# EAGLE design cfc-sensor-card (EAGLE 9.5.1)

## Sheet 1 of 4: Connectors
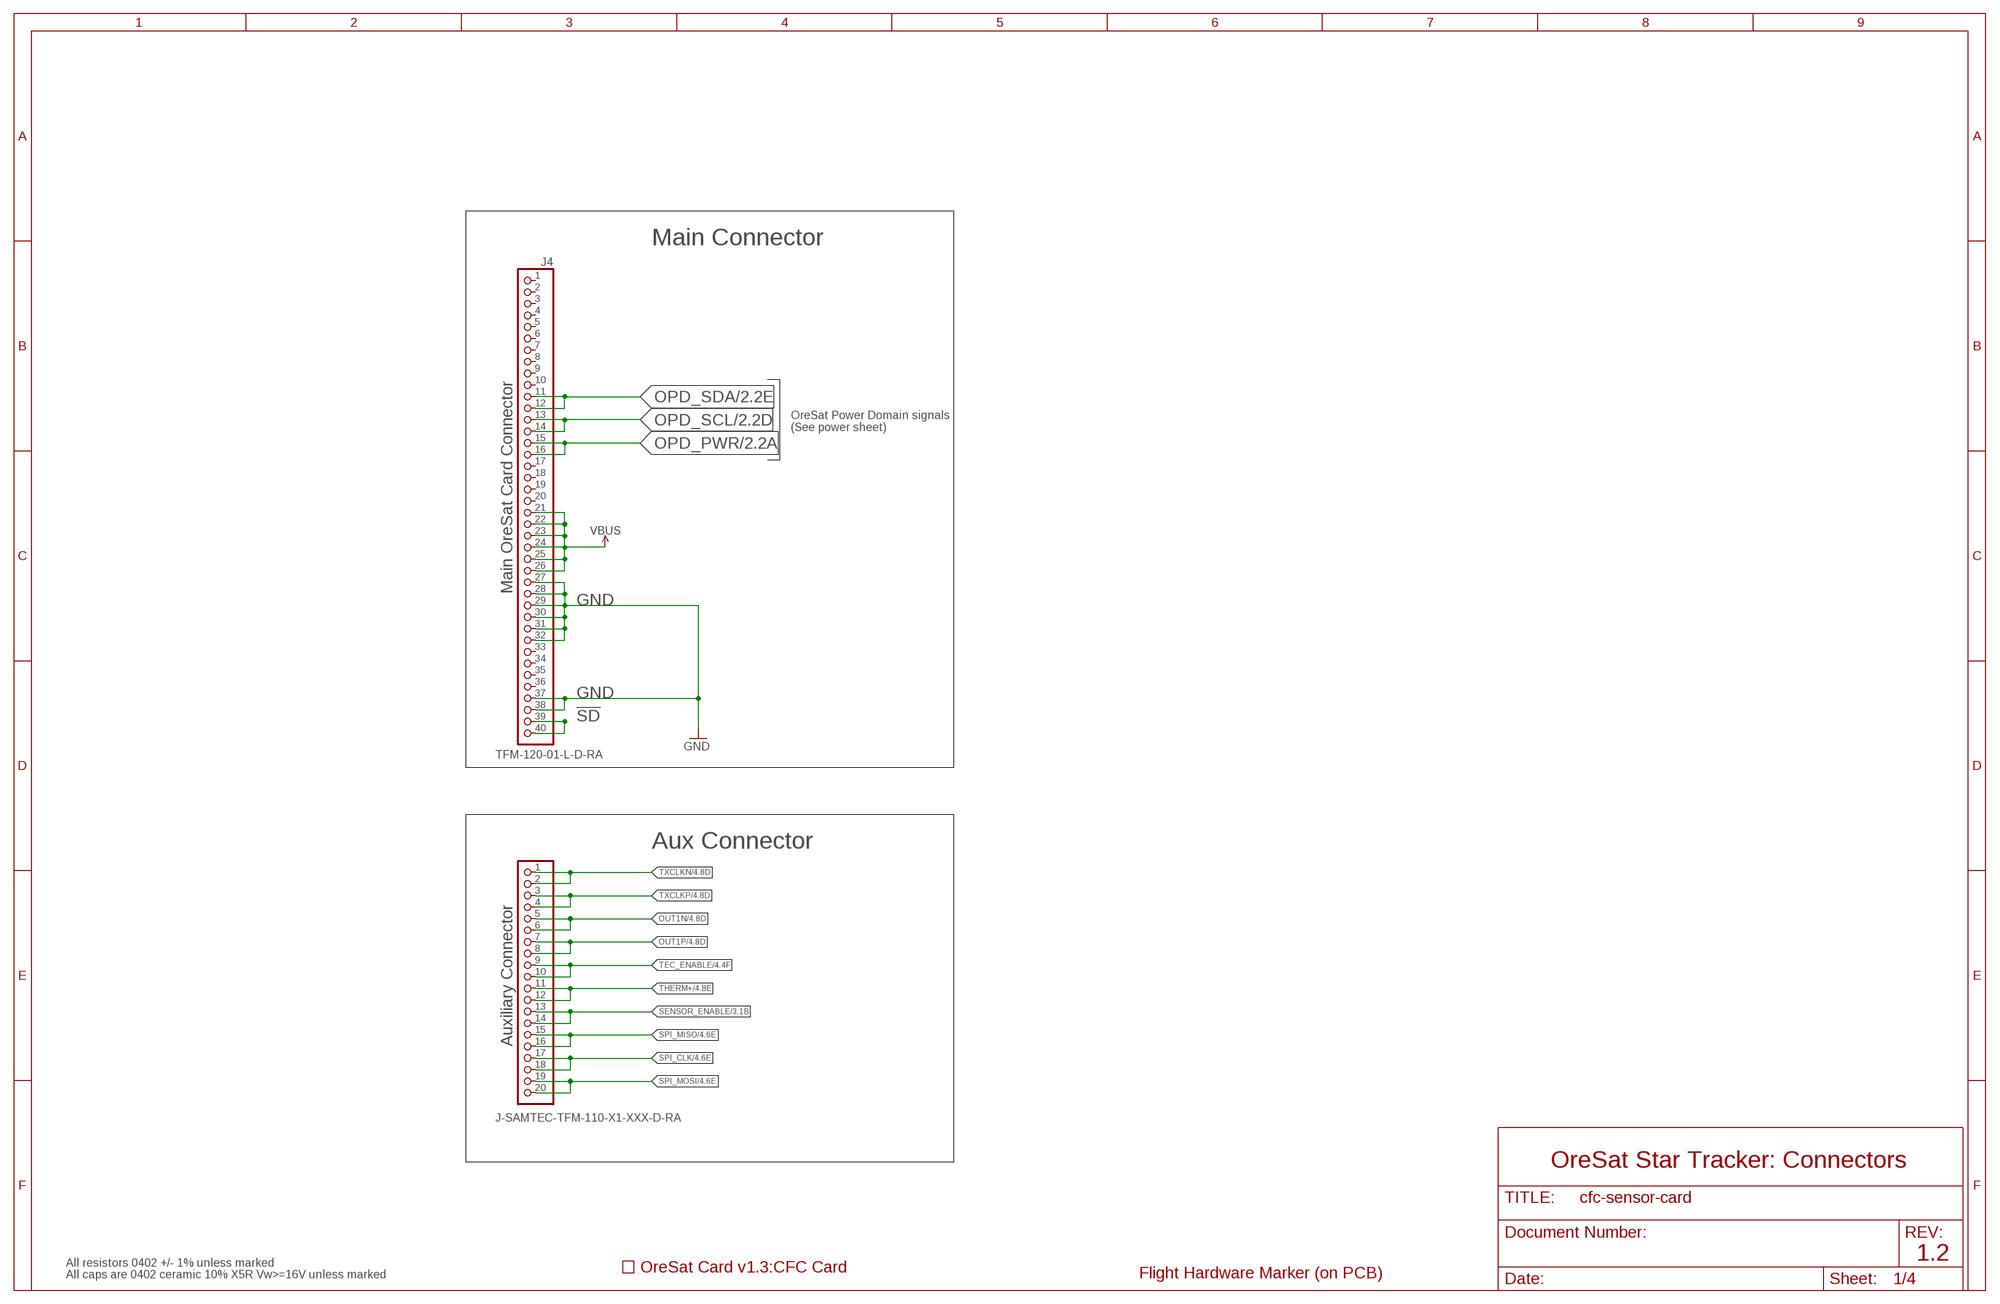
[diagram p0: schematic, sheet 1]

### Parts
J2  J-SAMTEC-TFM-110-X1-XXX-D-RA  [J-SAMTEC-TFM-110-X1-XXX-D-RA]
J4  TFM-120-01-L-D-RA  J-SAMTEC-TFM-120-X1-XXX-D-RA  [J-SAMTEC-TFM-120-X1-XXX-D-RA]
PCB1  ORESAT-CARD-V1.3-CFC  [ORESAT-CARD-V1.3-CFC]
U$1  FLIGHMARKERNEW  [FLIGHTMARKER_NEW_BOARDS]

### Nets
!SD: J4.39 J4.40
GND: J4.27 J4.28 J4.29 J4.30 J4.31 J4.32 J4.37 J4.38 ; also sheet 2,3,4
OPD_PWR: J4.15 J4.16 ; also sheet 2
OPD_SCL: J4.13 J4.14 ; also sheet 2
OPD_SDA: J4.11 J4.12 ; also sheet 2
OUT1N [diff pair]: J2.5 J2.6 ; also sheet 4
OUT1P [diff pair]: J2.7 J2.8 ; also sheet 4
SENSOR_ENABLE: J2.13 J2.14 ; also sheet 3
SPI_CLK: J2.17 J2.18 ; also sheet 4
SPI_MISO: J2.15 J2.16 ; also sheet 4
SPI_MOSI: J2.19 J2.20 ; also sheet 4
TEC_ENABLE: J2.9 J2.10 ; also sheet 4
THERM+: J2.11 J2.12 ; also sheet 4
TXCLKN [diff pair]: J2.1 J2.2 ; also sheet 4
TXCLKP [diff pair]: J2.3 J2.4 ; also sheet 4
VBUS: J4.21 J4.22 J4.23 J4.24 J4.25 J4.26 ; also sheet 2
Unconnected: J4.1 J4.2 J4.3 J4.4 J4.5 J4.6 J4.7 J4.8 J4.9 J4.10 J4.17 J4.18 J4.19 J4.20 J4.33 J4.34 J4.35 J4.36

### Notes on the sheet
- Main Connector
- OreSat Power Domain signals
  (See power sheet)
- Main OreSat Card Connector
- Aux Connector
- Auxiliary Connector
- OreSat Star Tracker: Connectors
- 1.2
- All resistors 0402 +/- 1% unless marked
- All caps are 0402 ceramic 10% X5R Vw>=16V unless marked

## Sheet 2 of 4: OPD
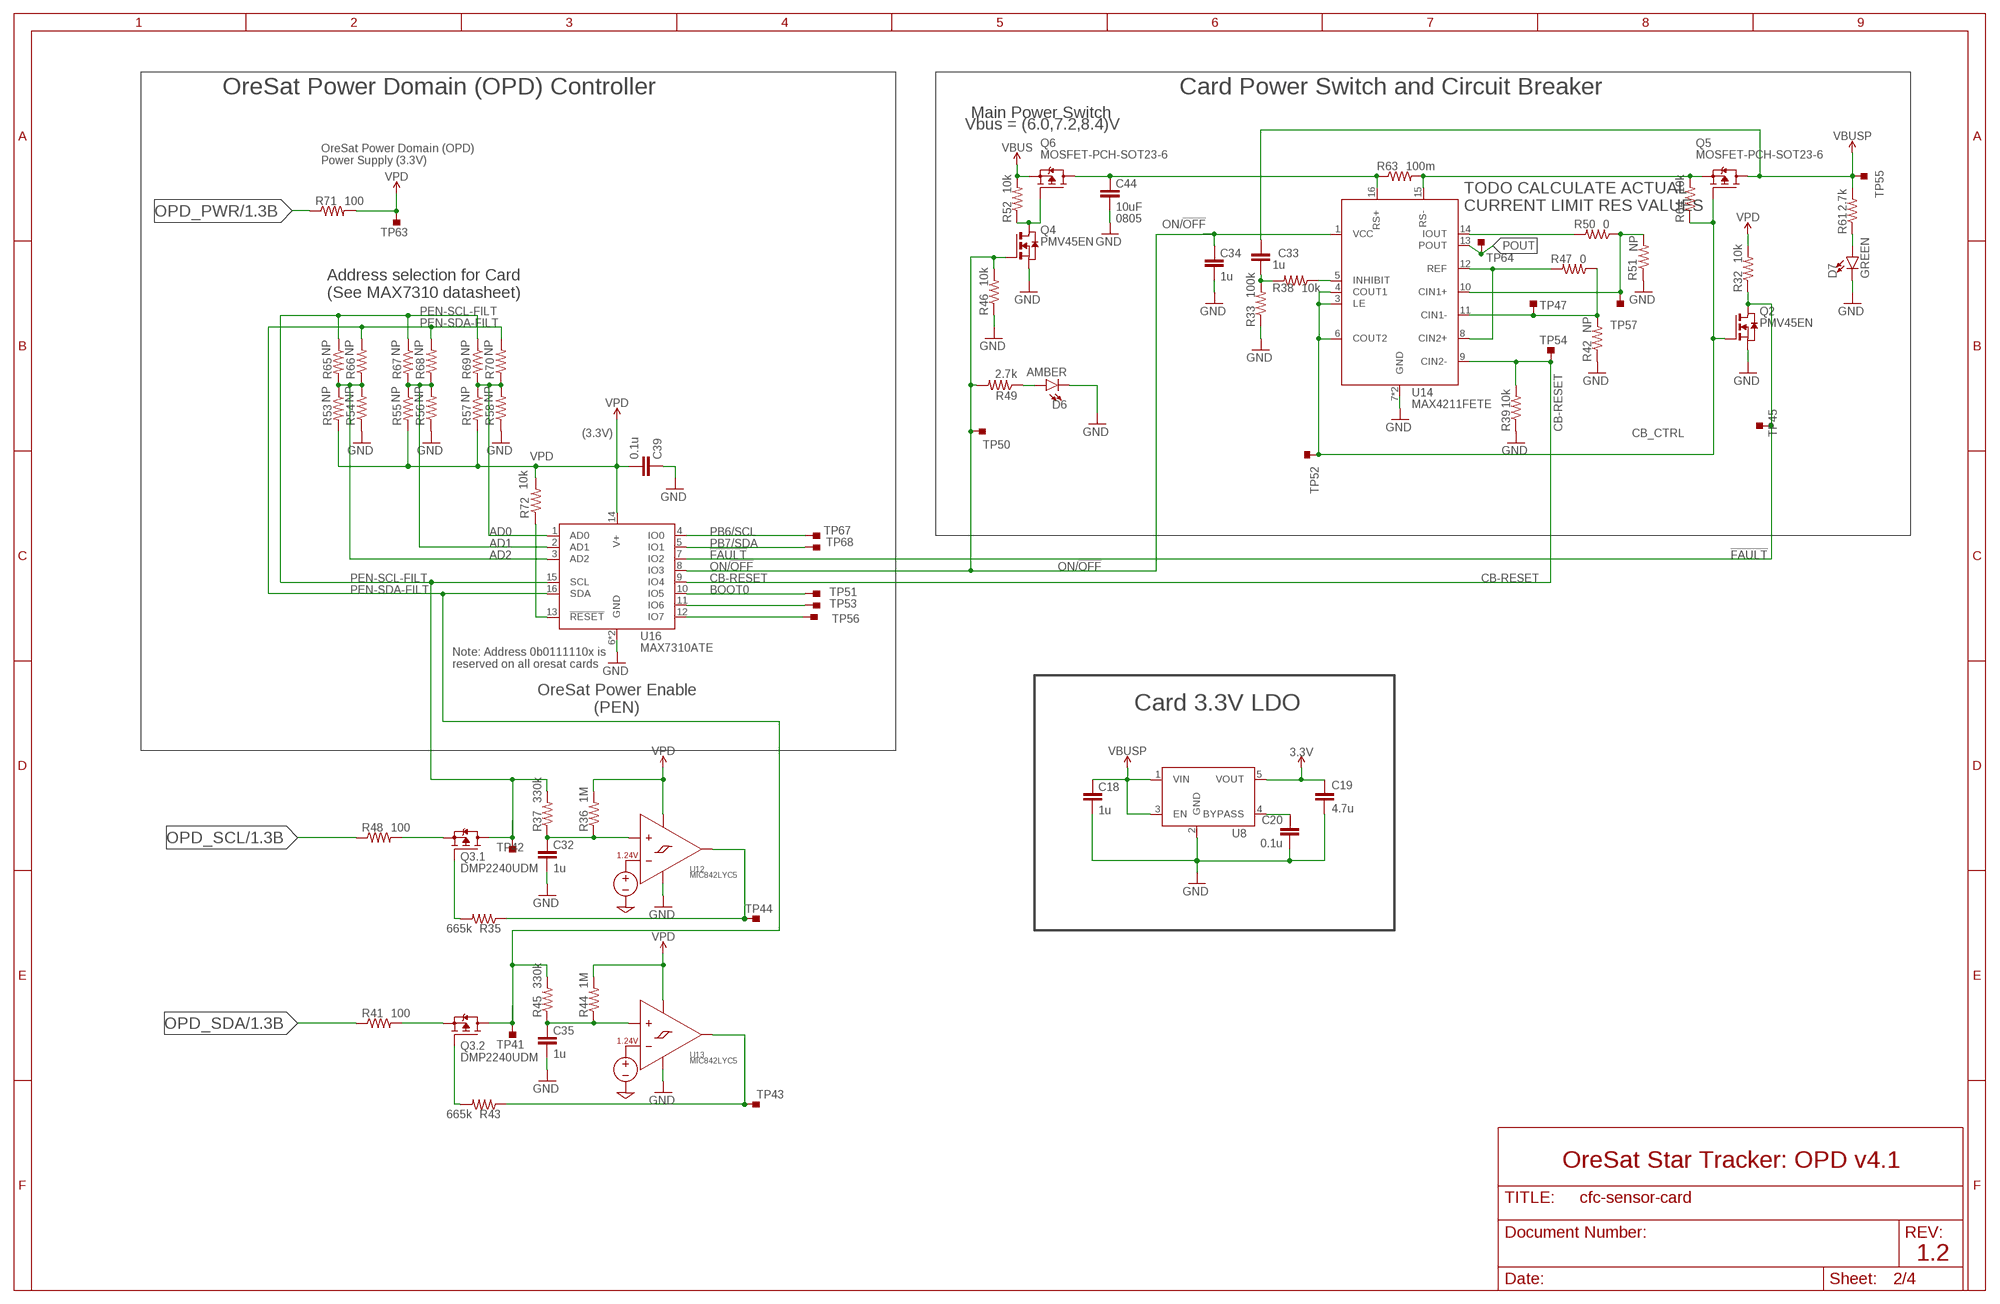
[diagram p1: schematic, sheet 2]

### Parts
C18  1u  C-EU0603-B  [.0603-B]
C19  4.7u  C-EU0603-B  [.0603-B]
C20  0.1u  C-EU0603-B  [.0603-B]
C32  1u  C-EU0603-B  [.0603-B]
C33  1u  C-EU0603-B  [.0603-B]
C34  1u  C-EU0603-B  [.0603-B]
C35  1u  C-EU0603-B  [.0603-B]
C39  0.1u  C-EU0603-B  [.0603-B]
C44  10uF  C-EU0603-B  [.0603-B]
D6  AMBER  LED-GREEN0603  [LED-0603]
D7  GREEN  LED-GREEN0603  [LED-0603]
Q2  PMV45EN  [SOT23]
Q3  DMP2240UDM  MOSFET-PCH-SOT23-6  [SOT23-6]
Q4  PMV45EN  [SOT23]
Q5  MOSFET-PCH-SOT23-6  [SOT23-6]
Q6  MOSFET-PCH-SOT23-6  [SOT23-6]
R32  10k  R-US_0603-B  [.0603-B]
R33  100k  R-US_0603-B  [.0603-B]
R35  665k  R-US_0603-B  [.0603-B]
R36  1M  R-US_0603-B  [.0603-B]
R37  330k  R-US_0603-B  [.0603-B]
R38  10k  R-US_0603-B  [.0603-B]
R39  10k  R-US_0603-B  [.0603-B]
R41  100  R-US_0603-B  [.0603-B]
R42  NP  R-US_0603-B  [.0603-B]
R43  665k  R-US_0603-B  [.0603-B]
R44  1M  R-US_0603-B  [.0603-B]
R45  330k  R-US_0603-B  [.0603-B]
R46  10k  R-US_0603-B  [.0603-B]
R47  0  R-US_0603-B  [.0603-B]
R48  100  R-US_0603-B  [.0603-B]
R49  2.7k  R-US_0603-B  [.0603-B]
R50  0  R-US_0603-B  [.0603-B]
R51  NP  R-US_0603-B  [.0603-B]
R52  10k  R-US_0603-B  [.0603-B]
R53  NP  R-US_0603-B  [.0603-B]
R54  NP  R-US_0603-B  [.0603-B]
R55  NP  R-US_0603-B  [.0603-B]
R56  NP  R-US_0603-B  [.0603-B]
R57  NP  R-US_0603-B  [.0603-B]
R58  NP  R-US_0603-B  [.0603-B]
R61  2.7k  R-US_0603-B  [.0603-B]
R63  100m  R-US_R1206  [R1206]
R64  10k  R-US_0603-B  [.0603-B]
R65  NP  R-US_0603-B  [.0603-B]
R66  NP  R-US_0603-B  [.0603-B]
R67  NP  R-US_0603-B  [.0603-B]
R68  NP  R-US_0603-B  [.0603-B]
R69  NP  R-US_0603-B  [.0603-B]
R70  NP  R-US_0603-B  [.0603-B]
R71  100  R-US_0603-B  [.0603-B]
R72  10k  R-US_0603-B  [.0603-B]
TP41  TEST-POINT_SMD-SMD-10SN  [TESTPOINT_SMD-10SN]
TP42  TEST-POINT_SMD-SMD-10SN  [TESTPOINT_SMD-10SN]
TP43  TEST-POINT_SMD-SMD-10SN  [TESTPOINT_SMD-10SN]
TP44  TEST-POINT_SMD-SMD-10SN  [TESTPOINT_SMD-10SN]
TP45  TEST-POINT_SMD-SMD-10SN  [TESTPOINT_SMD-10SN]
TP47  TEST-POINT_SMD-SMD-10SN  [TESTPOINT_SMD-10SN]
TP50  TEST-POINT_SMD-SMD-10SN  [TESTPOINT_SMD-10SN]
TP51  TEST-POINT_SMD-SMD-10SN  [TESTPOINT_SMD-10SN]
TP52  TEST-POINT_SMD-SMD-10SN  [TESTPOINT_SMD-10SN]
TP53  TEST-POINT_SMD-SMD-10SN  [TESTPOINT_SMD-10SN]
TP54  TEST-POINT_SMD-SMD-10SN  [TESTPOINT_SMD-10SN]
TP55  TEST-POINT_SMD-SMD-10SN  [TESTPOINT_SMD-10SN]
TP56  TEST-POINT_SMD-SMD-10SN  [TESTPOINT_SMD-10SN]
TP57  TEST-POINT_SMD-SMD-10SN  [TESTPOINT_SMD-10SN]
TP63  TEST-POINT_SMD-SMD-10SN  [TESTPOINT_SMD-10SN]
TP64  TEST-POINT_SMD-SMD-10SN  [TESTPOINT_SMD-10SN]
TP67  TEST-POINT_SMD-SMD-10SN  [TESTPOINT_SMD-10SN]
TP68  TEST-POINT_SMD-SMD-10SN  [TESTPOINT_SMD-10SN]
U8  LP2985AIM5-3.3_NOPB  [SOT-23]
U12  MIC842LYC5  [SC70-5]
U13  MIC842LYC5  [SC70-5]
U14  MAX4211FETE  MAX4211  [QFN65P400X400X80-17T210]
U16  MAX7310ATE  MAX7310  [QFN65P400X400X80-17T210]

### Nets
3.3V: C19.1 U8.5(VOUT) ; also sheet 3,4
!FAULT: Q2.3(D) R32.1 TP45.TP U16.7(IO2)
AD0: R57.1 R58.2 R69.2 R70.1 U16.1(AD0)
AD1: R55.1 R56.2 R67.2 R68.1 U16.2(AD1)
AD2: R53.1 R54.2 R65.2 R66.1 U16.3(AD2)
BOOT0: TP51.TP U16.10(IO5)
CB-RESET: R39.2 TP54.TP U14.9(CIN2-) U16.9(IO4)
CB_CTRL: Q2.1(G) Q5.3(G) R64.1 TP52.TP U14.3(LE) U14.4(COUT1) U14.6(COUT2)
GND: C18.2 C19.2 C20.2 C32.2 C34.2 C35.2 C39.1 C44.2 D6.C D7.C Q2.2(S) Q4.2(S) R33.1 R39.1 R42.1 R46.1 R51.1 R54.1 R56.1 R58.1 U8.2(GND) U12.2(GND) U13.2(GND) U14.7(GND) U14.EPAD(GND) U16.6(GND) U16.EPAD(GND) ; also sheet 1,3,4
IOUT: R50.2 U14.14(IOUT)
N$18: C20.1 U8.4(BYPASS)
N$25: C32.1 R36.1 R37.1 U12.1(INP)
N$27: R35.1 TP44.TP U12.4(OUT)
N$32: TP56.TP U16.12(IO7)
N$98: C44.1 Q6.1(D) Q6.2(D) Q6.5(D) Q6.6(D) R63.1 U14.16(RS+)
N$99: Q5.4(S) R63.2 R64.2 U14.15(RS-)
N$100: C35.1 R44.1 R45.1 U13.1(INP)
N$113: Q3.3(.2:G) R43.2
N$117: Q3.1(.1:G) R35.2
N$270: D7.A R61.1
N$385: TP53.TP U16.11(IO6)
N$479: Q3.5(.1:S) R48.2
N$575: D6.A R49.1
N$579: Q3.2(.2:S) R41.2
N$580: R43.1 TP43.TP U13.4(OUT)
N$589: R72.1 U16.13(!RESET)
N$590: Q4.3(D) Q6.3(G) R52.1
N$596: R50.1 R51.2 TP57.TP U14.10(CIN1+)
N$597: R42.2 R47.1 TP47.TP U14.11(CIN1-)
N$599: R47.2 U14.8(CIN2+) U14.12(REF)
N$603: C33.1 R33.2 R38.2
N$604: R38.1 U14.5(INHIBIT)
ON/!OFF: C34.1 Q4.1(G) R46.2 R49.2 TP50.TP U14.1(VCC) U16.8(IO3)
OPD_PWR: R71.1 ; also sheet 1
OPD_SCL: R48.1 ; also sheet 1
OPD_SDA: R41.1 ; also sheet 1
PB6/SCL: TP67.TP U16.4(IO0)
PB7/SDA: TP68.TP U16.5(IO1)
PEN-SCL-FILT: Q3.6(.1:D) R37.2 R65.1 R67.1 R69.1 TP42.TP U16.15(SCL)
PEN-SDA-FILT: Q3.4(.2:D) R45.2 R66.2 R68.2 R70.2 TP41.TP U16.16(SDA)
POUT: TP64.TP U14.13(POUT)
VBUS: Q6.4(S) R52.2 ; also sheet 1
VBUSP: C18.1 C33.2 Q5.1(D) Q5.2(D) Q5.5(D) Q5.6(D) R61.2 TP55.TP U8.1(VIN) U8.3(EN) ; also sheet 3,4
VPD: C39.2 R32.2 R36.2 R44.2 R53.2 R55.2 R57.2 R71.2 R72.2 TP63.TP U12.5(VDD) U13.5(VDD) U16.14(V+)

### Notes on the sheet
- OreSat Power Domain (OPD) Controller | Card Power Switch and Circuit Breaker
- Main Power Switch
- Vbus = (6.0,7.2,8.4)V
- OreSat Power Domain (OPD)
  Power Supply (3.3V)
- TODO CALCULATE ACTUAL 
  CURRENT LIMIT RES VALUES
- 0805
- Address selection for Card
  (See MAX7310 datasheet)
- (3.3V)
- Note: Address 0b0111110x is 
  reserved on all oresat cards
- OreSat Power Enable
  (PEN)
- Card 3.3V LDO
- OreSat Star Tracker: OPD v4.1
- 1.2

## Sheet 3 of 4: PIRT1280 Power
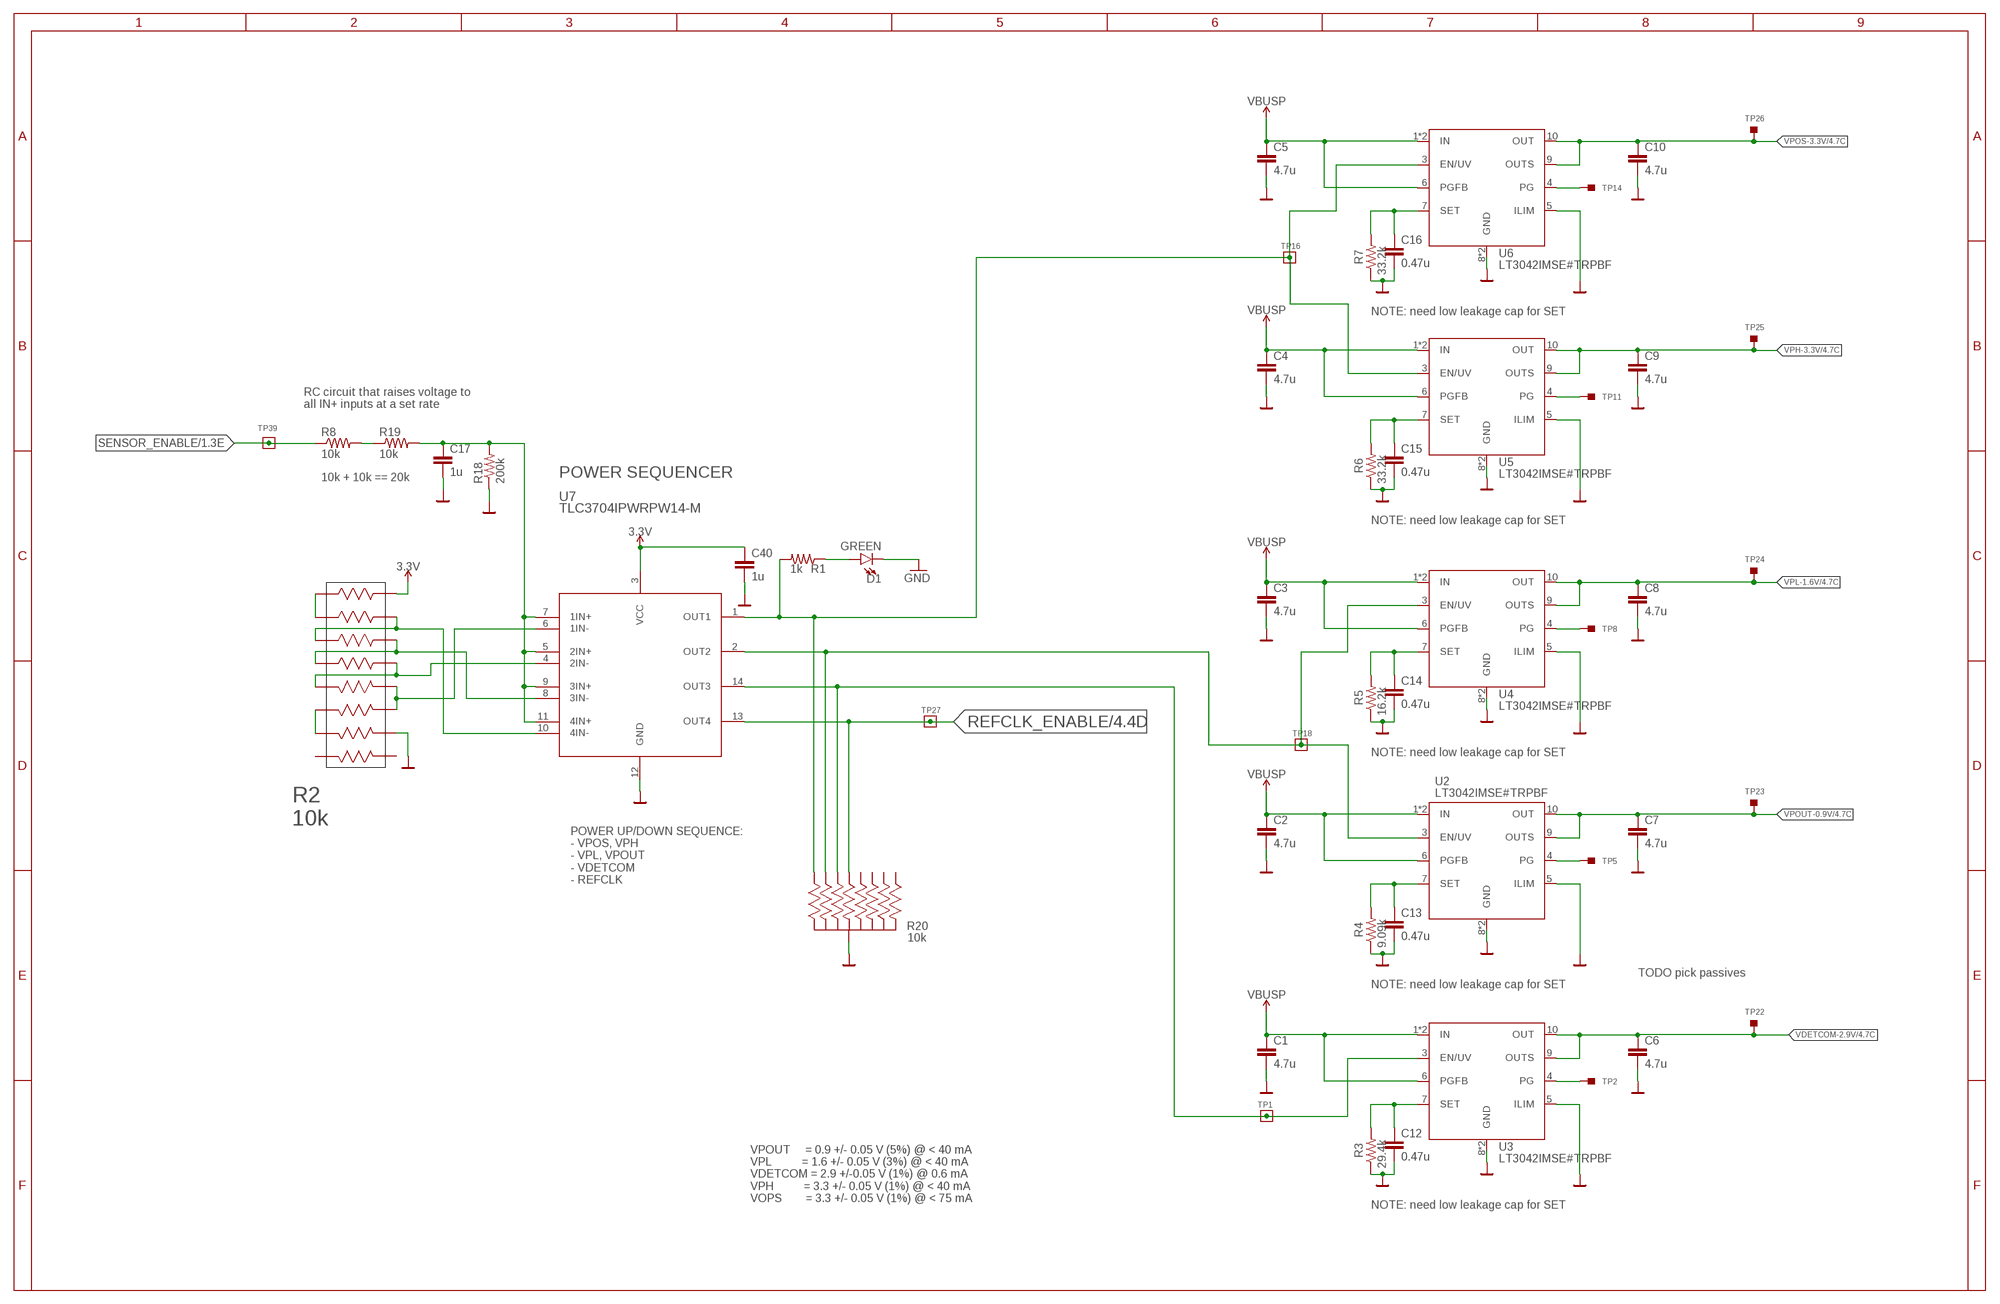
[diagram p2: schematic, sheet 3]

### Parts
C1  4.7u  C-EU0603-B  [.0603-B]
C2  4.7u  C-EU0603-B  [.0603-B]
C3  4.7u  C-EU0603-B  [.0603-B]
C4  4.7u  C-EU0603-B  [.0603-B]
C5  4.7u  C-EU0603-B  [.0603-B]
C6  4.7u  C-EU0603-B  [.0603-B]
C7  4.7u  C-EU0603-B  [.0603-B]
C8  4.7u  C-EU0603-B  [.0603-B]
C9  4.7u  C-EU0603-B  [.0603-B]
C10  4.7u  C-EU0603-B  [.0603-B]
C12  0.47u  C-EU0603-B  [.0603-B]
C13  0.47u  C-EU0603-B  [.0603-B]
C14  0.47u  C-EU0603-B  [.0603-B]
C15  0.47u  C-EU0603-B  [.0603-B]
C16  0.47u  C-EU0603-B  [.0603-B]
C17  1u  C-EU0603-B  [.0603-B]
C40  1u  C-EU0603-B  [.0603-B]
D1  GREEN  LED-GREEN0603  [LED-0603]
R1  1k  R-US_0603-B  [.0603-B]
R2  10k  EXB-2HV103JV-LEGACY  [RES_EXB2HV]
R3  29.4k  R-US_0603-B  [.0603-B]
R4  9.09k  R-US_0603-B  [.0603-B]
R5  16.2k  R-US_0603-B  [.0603-B]
R6  33.2k  R-US_0603-B  [.0603-B]
R7  33.2k  R-US_0603-B  [.0603-B]
R8  10k  R-US_0603-B  [.0603-B]
R18  200k  R-US_0603-B  [.0603-B]
R19  10k  R-US_0603-B  [.0603-B]
R20  10k  EXB-A10P391JC_ARRAY_EXBA-M  [ARRAY_EXBA-M]
TP1  TEST-POINT-LARGE-SQUARE  [1X01]
TP2  TEST-POINT_SMD-SMD-10SN  [TESTPOINT_SMD-10SN]
TP5  TEST-POINT_SMD-SMD-10SN  [TESTPOINT_SMD-10SN]
TP8  TEST-POINT_SMD-SMD-10SN  [TESTPOINT_SMD-10SN]
TP11  TEST-POINT_SMD-SMD-10SN  [TESTPOINT_SMD-10SN]
TP14  TEST-POINT_SMD-SMD-10SN  [TESTPOINT_SMD-10SN]
TP16  TEST-POINT-LARGE-SQUARE  [1X01]
TP18  TEST-POINT-LARGE-SQUARE  [1X01]
TP22  TEST-POINT_SMD-SMD-10SN  [TESTPOINT_SMD-10SN]
TP23  TEST-POINT_SMD-SMD-10SN  [TESTPOINT_SMD-10SN]
TP24  TEST-POINT_SMD-SMD-10SN  [TESTPOINT_SMD-10SN]
TP25  TEST-POINT_SMD-SMD-10SN  [TESTPOINT_SMD-10SN]
TP26  TEST-POINT_SMD-SMD-10SN  [TESTPOINT_SMD-10SN]
TP27  TEST-POINT-LARGE-SQUARE  [1X01]
TP39  TEST-POINT-LARGE-SQUARE  [1X01]
U2  LT3042IMSE#TRPBF  [SOP50P490X110-11N]
U3  LT3042IMSE#TRPBF  [SOP50P490X110-11N]
U4  LT3042IMSE#TRPBF  [SOP50P490X110-11N]
U5  LT3042IMSE#TRPBF  [SOP50P490X110-11N]
U6  LT3042IMSE#TRPBF  [SOP50P490X110-11N]
U7  TLC3704IPWRPW14-M  [14-TSSOP]

### Nets
3.3V: C40.1 R2.16 U7.3(VCC) ; also sheet 2,4
GND: C1.2 C2.2 C3.2 C4.2 C5.2 C6.2 C7.2 C8.2 C9.2 C10.2 C12.2 C13.2 C14.2 C15.2 C16.2 C17.2 C40.2 D1.C R2.10 R3.1 R4.1 R5.1 R6.1 R7.1 R18.1 R20.5 R20.10 U2.5(ILIM) U2.8(GND) U2.11(GND) U3.5(ILIM) U3.8(GND) U3.11(GND) U4.5(ILIM) U4.8(GND) U4.11(GND) U5.5(ILIM) U5.8(GND) U5.11(GND) U6.5(ILIM) U6.8(GND) U6.11(GND) U7.12(GND) ; also sheet 1,2,4
N$1: R1.2 R20.6 TP16.1 U5.3(EN/UV) U6.3(EN/UV) U7.1(OUT1)
N$2: R8.2 R19.1
N$4: R2.1 R2.2
N$5: R2.3 R2.15 U7.10(4IN-)
N$6: R2.4 R2.14 U7.8(3IN-)
N$7: R2.5 R2.13 U7.4(2IN-)
N$8: R2.6 R2.7
N$9: C17.1 R18.2 R19.2 U7.5(2IN+) U7.7(1IN+) U7.9(3IN+) U7.11(4IN+)
N$10: R20.7 TP1.1 U3.3(EN/UV) U7.14(OUT3)
N$13: D1.A R1.1
N$15: TP5.TP U2.4(PG)
N$20: C13.1 R4.2 U2.7(SET)
N$23: TP2.TP U3.4(PG)
N$24: C12.1 R3.2 U3.7(SET)
N$28: TP14.TP U6.4(PG)
N$29: C16.1 R7.2 U6.7(SET)
N$33: TP11.TP U5.4(PG)
N$35: C15.1 R6.2 U5.7(SET)
N$36: R20.4 TP18.1 U2.3(EN/UV) U4.3(EN/UV) U7.2(OUT2)
N$39: TP8.TP U4.4(PG)
N$40: C14.1 R5.2 U4.7(SET)
N$44: R2.11 R2.12 U7.6(1IN-)
REFCLK_ENABLE: R20.3 TP27.1 U7.13(OUT4) ; also sheet 4
SENSOR_ENABLE: R8.1 TP39.1 ; also sheet 1
VBUSP: C1.1 C2.1 C3.1 C4.1 C5.1 U2.1(IN) U2.2(IN) U2.6(PGFB) U3.1(IN) U3.2(IN) U3.6(PGFB) U4.1(IN) U4.2(IN) U4.6(PGFB) U5.1(IN) U5.2(IN) U5.6(PGFB) U6.1(IN) U6.2(IN) U6.6(PGFB) ; also sheet 2,4
VDETCOM-2.9V: C6.1 TP22.TP U3.9(OUTS) U3.10(OUT) ; also sheet 4
VPH-3.3V: C9.1 TP25.TP U5.9(OUTS) U5.10(OUT) ; also sheet 4
VPL-1.6V: C8.1 TP24.TP U4.9(OUTS) U4.10(OUT) ; also sheet 4
VPOS-3.3V: C10.1 TP26.TP U6.9(OUTS) U6.10(OUT) ; also sheet 4
VPOUT-0.9V: C7.1 TP23.TP U2.9(OUTS) U2.10(OUT) ; also sheet 4
Unconnected: R2.8 R2.9 R20.1 R20.2 R20.8 R20.9

### Notes on the sheet
- NOTE: need low leakage cap for SET
- RC circuit that raises voltage to 
  all IN+ inputs at a set rate
- POWER SEQUENCER
- 10k + 10k == 20k
- NOTE: need low leakage cap for SET
- NOTE: need low leakage cap for SET
- POWER UP/DOWN SEQUENCE:
  - VPOS, VPH
  - VPL, VPOUT
  - VDETCOM
  - REFCLK
- TODO pick passives
- NOTE: need low leakage cap for SET
- NOTE: need low leakage cap for SET
- VPOUT     = 0.9 +/- 0.05 V (5%) @ < 40 mA
  VPL          = 1.6 +/- 0.05 V (3%) @ < 40 mA 
  VDETCOM = 2.9 +/-0.05 V (1%) @ 0.6 mA
  VPH          = 3.3 +/- 0.05 V (1%) @ < 40 mA
  VOPS        = 3.3 +/- 0.05 V (1%) @ < 75 mA

## Sheet 4 of 4: PIRT1280
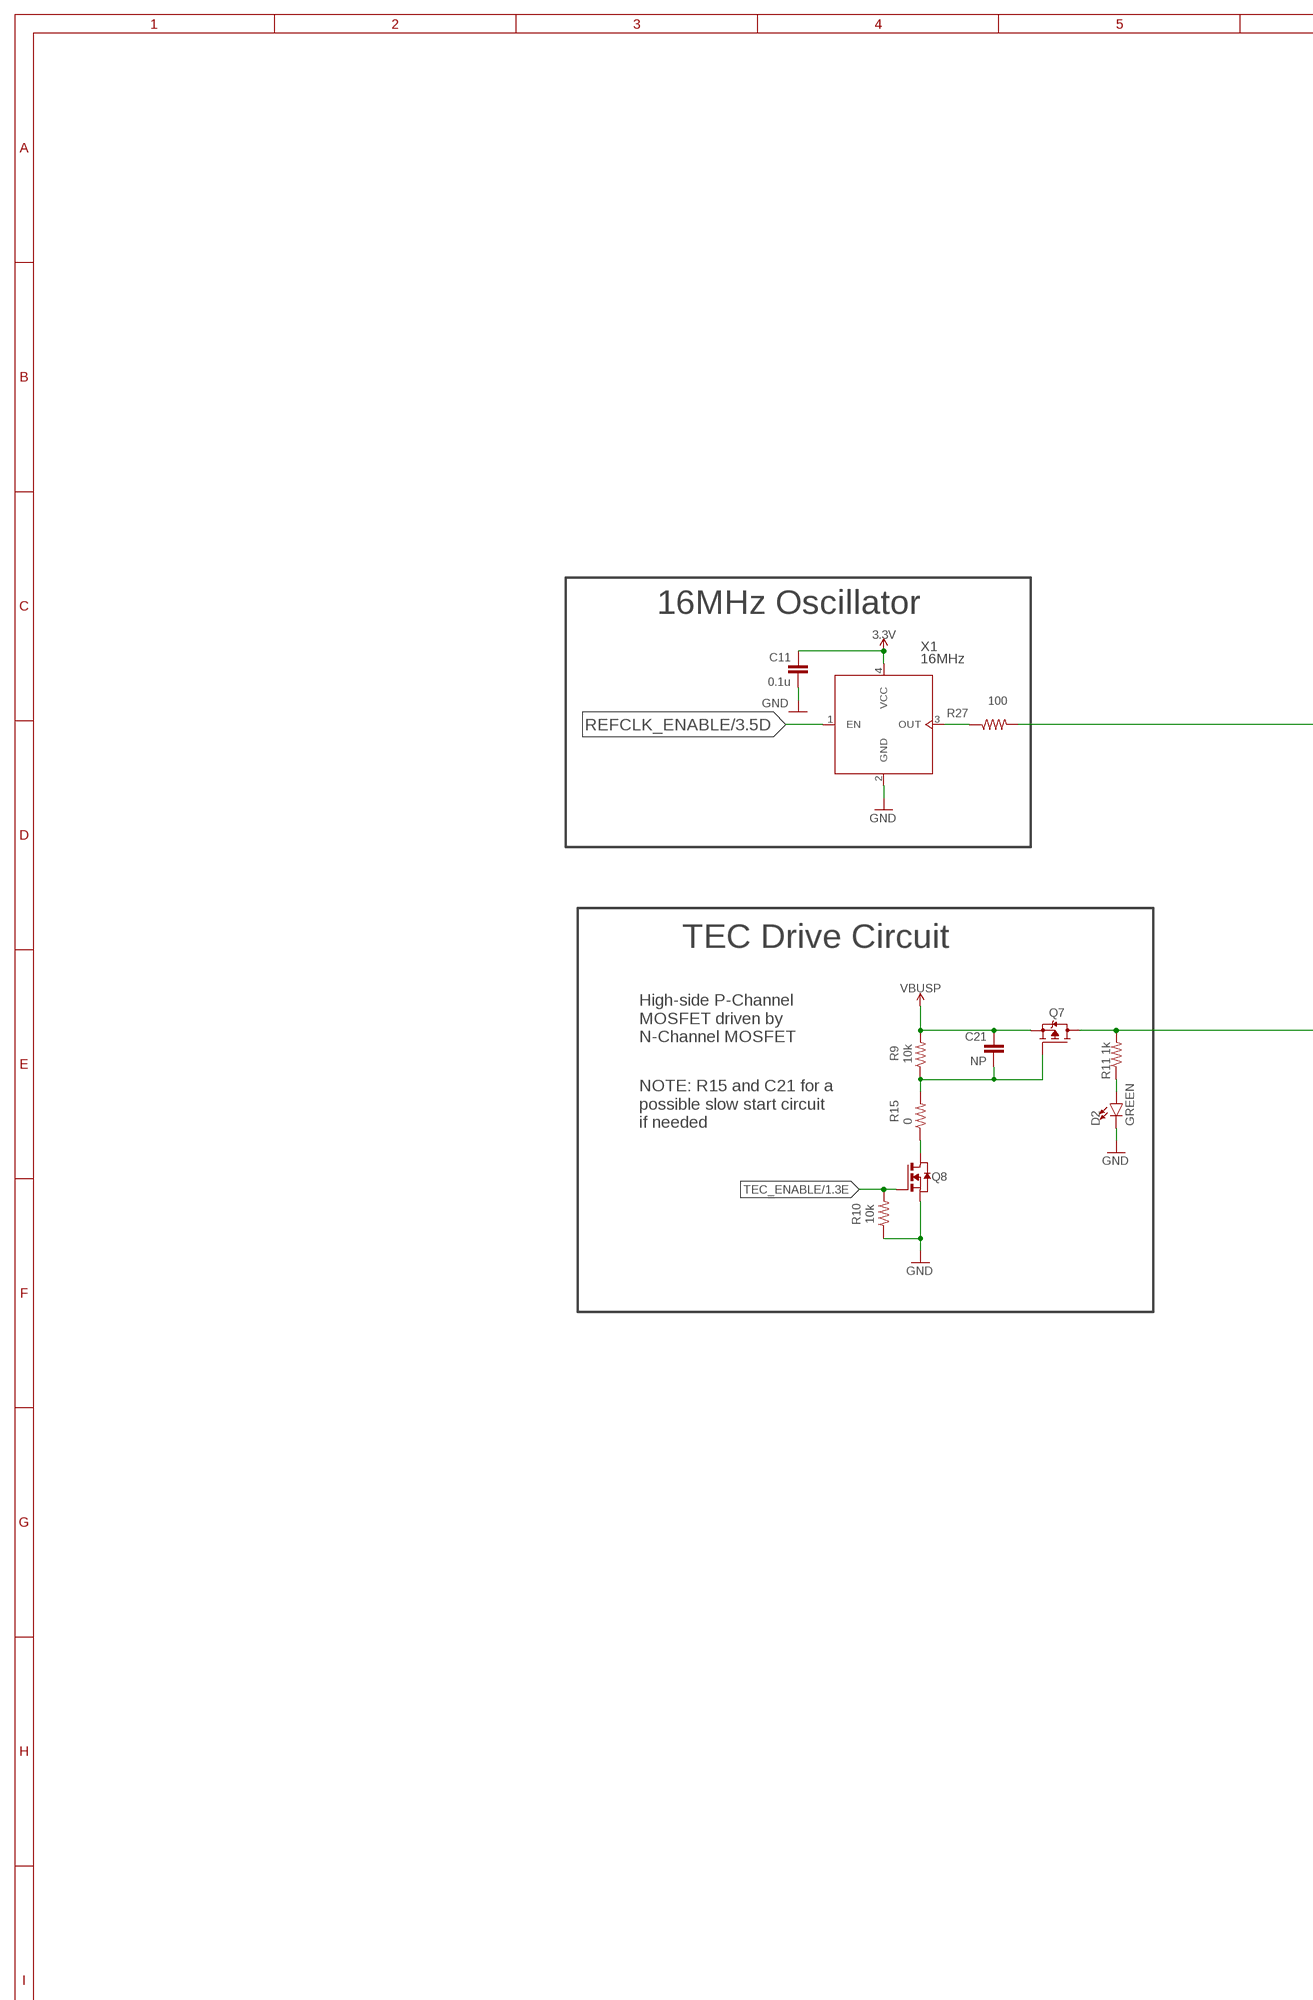
[diagram p3: schematic, sheet 4, part 1 of 2]
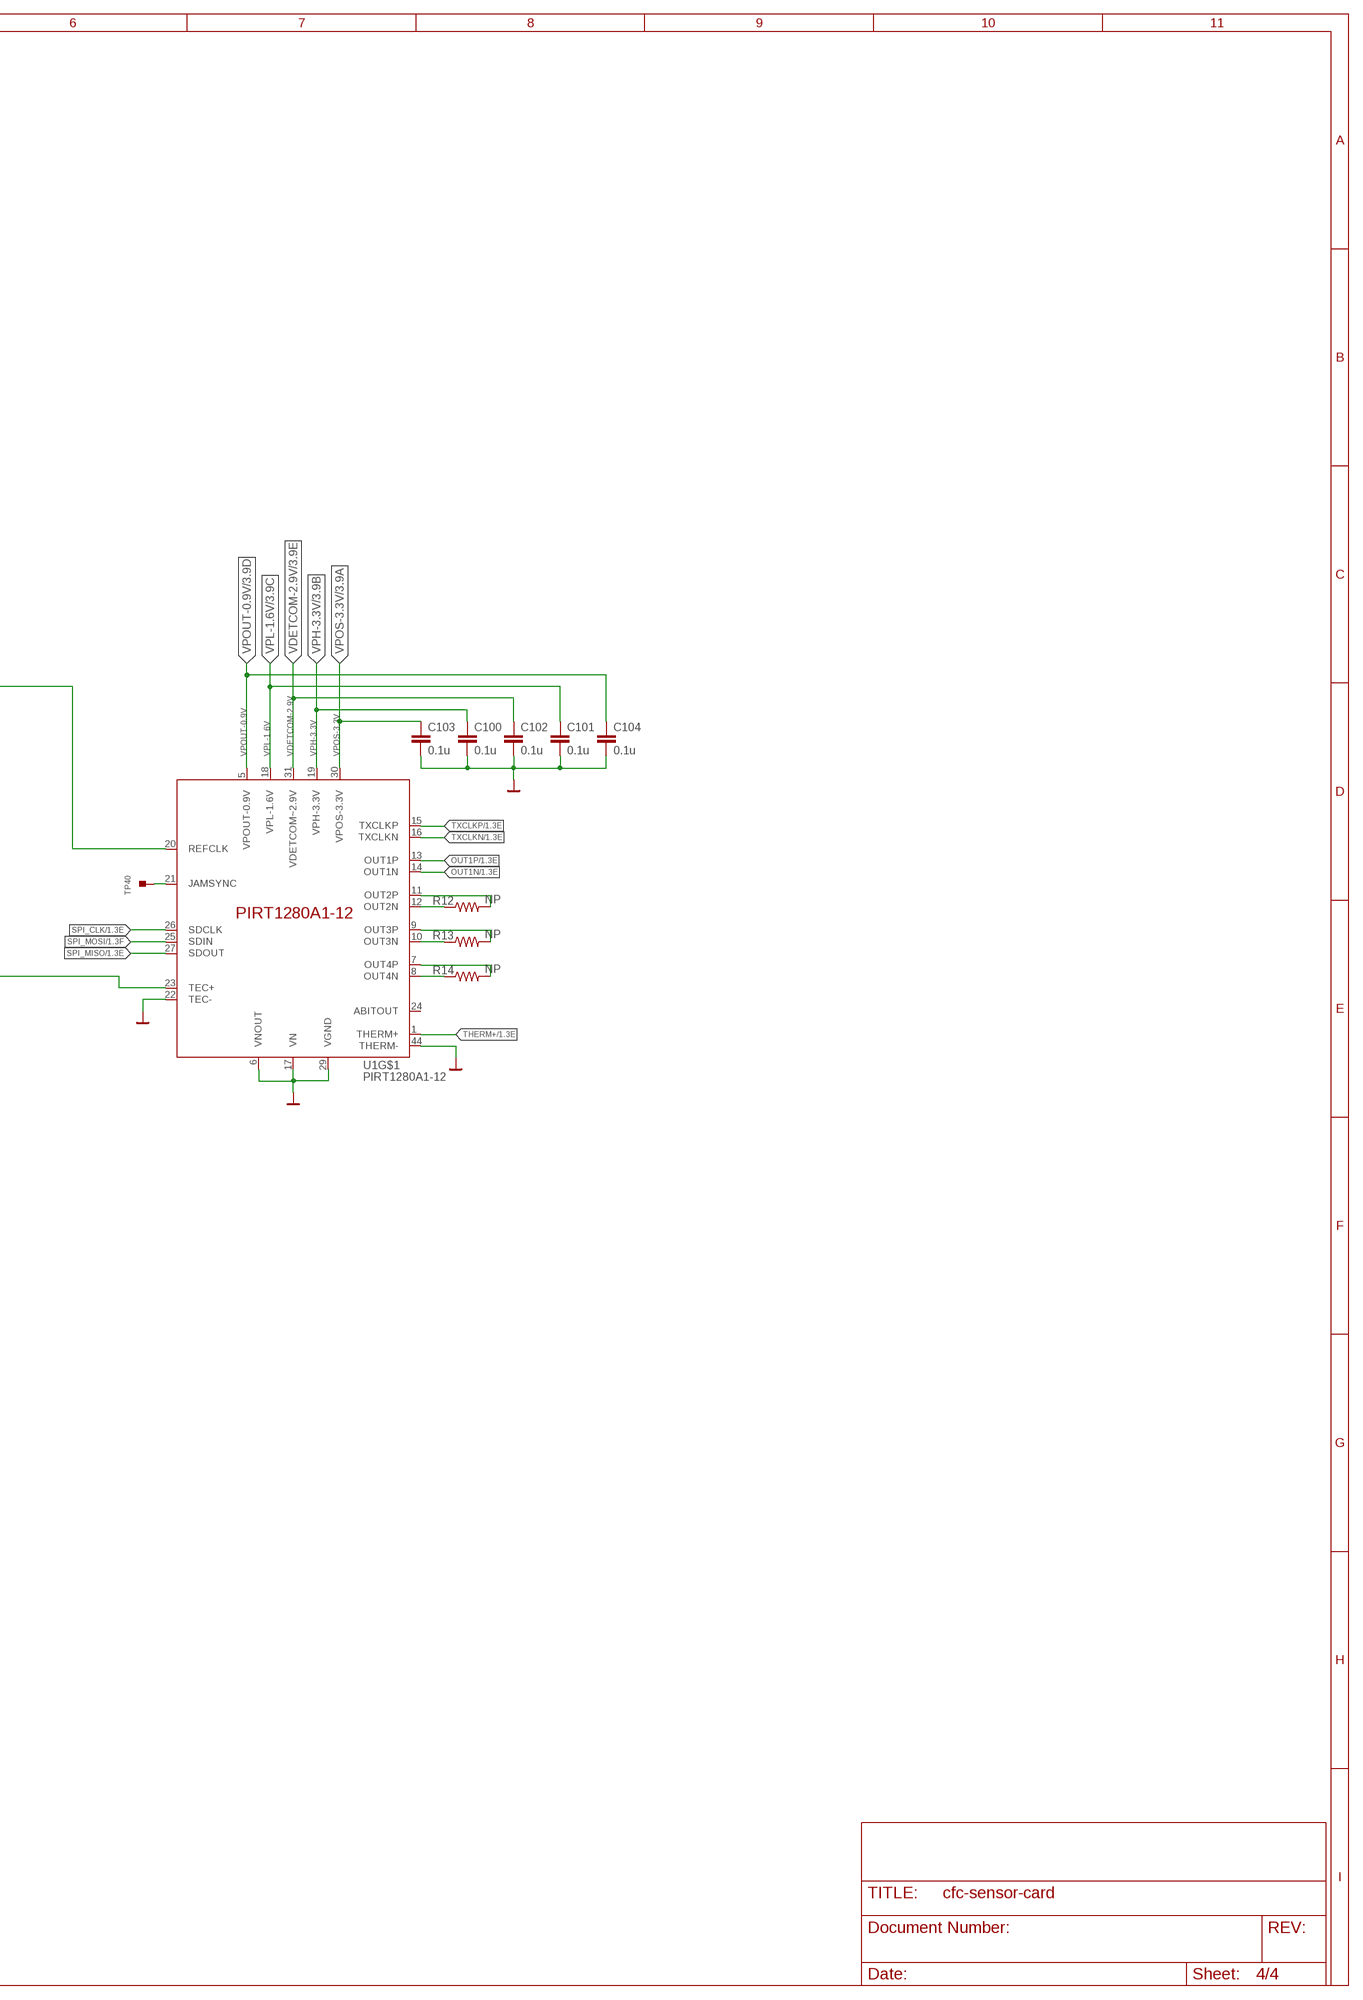
[diagram p4: schematic, sheet 4, part 2 of 2]

### Parts
C11  0.1u  C-EU0603-B  [.0603-B]
C21  NP  C-EU0603-B  [.0603-B]
C100  0.1u  C-EU0603-B  [.0603-B]
C101  0.1u  C-EU0603-B  [.0603-B]
C102  0.1u  C-EU0603-B  [.0603-B]
C103  0.1u  C-EU0603-B  [.0603-B]
C104  0.1u  C-EU0603-B  [.0603-B]
D2  GREEN  LED-GREEN0603  [LED-0603]
Q7  MOSFET-PCH-SOT23-6  [SOT23-6]
Q8  PMV45EN  [SOT23]
R9  10k  R-US_0603-B  [.0603-B]
R10  10k  R-US_0603-B  [.0603-B]
R11  1k  R-US_0603-B  [.0603-B]
R12  NP  R-US_0402-C-NOSILK  [.0402-C-NOSILK]
R13  NP  R-US_0402-C-NOSILK  [.0402-C-NOSILK]
R14  NP  R-US_0402-C-NOSILK  [.0402-C-NOSILK]
R15  0  R-US_0603-B  [.0603-B]
R27  100  R-US_0402-A  [.0402-A]
TP40  TEST-POINT_SMD-SMD-10SN  [TESTPOINT_SMD-10SN]
U1  PIRT1280A1-12  [PIRT1280A1-12]
X1  16MHz  OSC_GENERIC_2.5X2.0  [OSC_2.5X2.0]

### Nets
3.3V: C11.1 X1.4(VCC) ; also sheet 2,3
GND: C11.2 C100.2 C101.2 C102.2 C103.2 C104.2 D2.C Q8.2(S) R10.1 U1.6(VNOUT) U1.17(VN) U1.22(TEC-) U1.29(VGND) U1.44(THERM-) X1.2(GND) ; also sheet 1,2,3
N$3: C21.2 Q7.3(G) R9.1 R15.2
N$11: R12.2 U1.11(OUT2P)
N$12: D2.A R11.1
N$14: R27.1 X1.3(OUT)
N$16: TP40.TP U1.21(JAMSYNC)
N$17: R27.2 U1.20(REFCLK)
N$19: R12.1 U1.12(OUT2N)
N$21: R13.2 U1.9(OUT3P)
N$22: R13.1 U1.10(OUT3N)
N$26: R14.2 U1.7(OUT4P)
N$30: R14.1 U1.8(OUT4N)
N$31: Q8.3(D) R15.1
OUT1N [diff pair]: U1.14(OUT1N) ; also sheet 1
OUT1P [diff pair]: U1.13(OUT1P) ; also sheet 1
REFCLK_ENABLE: X1.1(EN) ; also sheet 3
SPI_CLK: U1.26(SDCLK) ; also sheet 1
SPI_MISO: U1.27(SDOUT) ; also sheet 1
SPI_MOSI: U1.25(SDIN) ; also sheet 1
TEC+: Q7.1(D) Q7.2(D) Q7.5(D) Q7.6(D) R11.2 U1.23(TEC+)
TEC_ENABLE: Q8.1(G) R10.2 ; also sheet 1
THERM+: U1.1(THERM+) ; also sheet 1
TXCLKN [diff pair]: U1.16(TXCLKN) ; also sheet 1
TXCLKP [diff pair]: U1.15(TXCLKP) ; also sheet 1
VBUSP: C21.1 Q7.4(S) R9.2 ; also sheet 2,3
VDETCOM-2.9V: C102.1 U1.31(VDETCOM~2.9V) ; also sheet 3
VPH-3.3V: C100.1 U1.19(VPH-3.3V) ; also sheet 3
VPL-1.6V: C101.1 U1.18(VPL-1.6V) ; also sheet 3
VPOS-3.3V: C103.1 U1.30(VPOS-3.3V) ; also sheet 3
VPOUT-0.9V: C104.1 U1.5(VPOUT-0.9V) ; also sheet 3
Unconnected: U1.2(IPLL) U1.3(DBITP) U1.4(DBITN) U1.24(ABITOUT) U1.28(SPARE1) U1.32(ITST0) U1.33(VTSTPAD) U1.34(ITWK) U1.35(VDET_TWK) U1.36(VHIPAD) U1.37(VLOPAD) U1.38(VBLM) U1.39(GUARD) U1.40(TEMP_MINUS) U1.41(TEMP_PLUS) U1.42(TRIG) U1.43(VCOMON)

### Notes on the sheet
- 16MHz Oscillator
- TEC Drive Circuit
- High-side P-Channel 
  MOSFET driven by 
  N-Channel MOSFET
- NOTE: R15 and C21 for a
  possible slow start circuit
  if needed

## Library data of the parts
C1-C21 C32-C35 C39 C40 C44 C100-C104 = oresat-rcl:C-EU: CAPACITOR, European symbol
D1 D2 = SparkFun-LED:LED-GREEN: Green SMD LED Used in manufacturing of various products at SparkFun Packages: 0603 - SMD 0603 package [Product Link] <http://www.futureelectronics.com/en/technologies/semiconductors/optoelectronics/leds/Pages/9894312-LTST-C190GKT.aspx?CrossPart=HSMG-C190&IM=0> LilyPad 1206 - SMD1206 LilyPad package [Product Link] <http://www.futureelectronics.com/en/Technologies/Product.aspx?ProductID=IN150NGHARVATEKCORPORATION2049943&IM=0> 1206 - SMD1206 package [Product Link] <http://www.futureelectronics.com/en/technologies/semiconductors/optoelectronics/leds/Pages/8315665-LTST-C150KGKT.aspx?IM=0> 1206 Bottom Mount -SMD 1206 Bottom Mount [Product Link] <http://www.digikey.com/product-detail/en/lite-on-inc/LTST-C230KGKT/160-1456-1-ND/386854> SparkFun Products: Pro Mini 328 -5V <https://www.sparkfun.com/products/821> RedBoard <https://www.sparkfun.com/products/12757> MP3 Trigger <https://www.sparkfun.com/products/13720> Makey Makey <https://www.sparkfun.com/products/11076>; DESCRIPTION: Green 573nm LED Indication - Discrete 2V 0603 (1608 Metric); DIGI-KEY_PART_NUMBER: 732-12017-1-ND; MANUFACTURER: Würth Elektronik; MANUFACTURER_PART_NUMBER: 150060VS55040
D6 = SparkFun-LED:LED-GREEN: Green SMD LED Used in manufacturing of various products at SparkFun Packages: 0603 - SMD 0603 package [Product Link] <http://www.futureelectronics.com/en/technologies/semiconductors/optoelectronics/leds/Pages/9894312-LTST-C190GKT.aspx?CrossPart=HSMG-C190&IM=0> LilyPad 1206 - SMD1206 LilyPad package [Product Link] <http://www.futureelectronics.com/en/Technologies/Product.aspx?ProductID=IN150NGHARVATEKCORPORATION2049943&IM=0> 1206 - SMD1206 package [Product Link] <http://www.futureelectronics.com/en/technologies/semiconductors/optoelectronics/leds/Pages/8315665-LTST-C150KGKT.aspx?IM=0> 1206 Bottom Mount -SMD 1206 Bottom Mount [Product Link] <http://www.digikey.com/product-detail/en/lite-on-inc/LTST-C230KGKT/160-1456-1-ND/386854> SparkFun Products: Pro Mini 328 -5V <https://www.sparkfun.com/products/821> RedBoard <https://www.sparkfun.com/products/12757> MP3 Trigger <https://www.sparkfun.com/products/13720> Makey Makey <https://www.sparkfun.com/products/11076>; VALUE: GREEN
D7 = SparkFun-LED:LED-GREEN: Green SMD LED Used in manufacturing of various products at SparkFun Packages: 0603 - SMD 0603 package [Product Link] <http://www.futureelectronics.com/en/technologies/semiconductors/optoelectronics/leds/Pages/9894312-LTST-C190GKT.aspx?CrossPart=HSMG-C190&IM=0> LilyPad 1206 - SMD1206 LilyPad package [Product Link] <http://www.futureelectronics.com/en/Technologies/Product.aspx?ProductID=IN150NGHARVATEKCORPORATION2049943&IM=0> 1206 - SMD1206 package [Product Link] <http://www.futureelectronics.com/en/technologies/semiconductors/optoelectronics/leds/Pages/8315665-LTST-C150KGKT.aspx?IM=0> 1206 Bottom Mount -SMD 1206 Bottom Mount [Product Link] <http://www.digikey.com/product-detail/en/lite-on-inc/LTST-C230KGKT/160-1456-1-ND/386854> SparkFun Products: Pro Mini 328 -5V <https://www.sparkfun.com/products/821> RedBoard <https://www.sparkfun.com/products/12757> MP3 Trigger <https://www.sparkfun.com/products/13720> Makey Makey <https://www.sparkfun.com/products/11076>
J2 = J-Samtec-TFM-110-X1-XXX-D-RA:J-SAMTEC-TFM-110-X1-XXX-D-RA; DIS: Digikey; DPN: SAM10113-ND; MFR: Samtec; MPN: TFM-110-01-L-D-RA
J4 = J-Samtec-TFM-120-X1-XXX-D-RA:J-SAMTEC-TFM-120-X1-XXX-D-RA; DPN: SAM10145-ND; MPN: TFM-120-01-L-D-RA
PCB1 = oresat-cards:ORESAT-CARD-V1.3-CFC
Q2 Q4 Q8 = Tova:PMV45EN; DPN: 1727-2307-1-ND; MPN: PMV45EN2R
Q3 = Q-MOSFET-PCH-dual-SOT23-6:MOSFET-PCH-SOT23-6: Dual P channel MOSFETs in an SOT23-6; MFR: Diodes Inc; MPN: DMP2240UDM-7
Q5-Q7 = Q-MOSFET-PCH-SOT23-6:MOSFET-PCH-SOT23-6: P channel MOSFET in an SOT23-6; DPN: DMP3050LVT-7DICT-ND; MPN: DMP3050LVT-7
R1 R3-R11 R15 R18 R19 R32 R35-R37 R39 R41 R43-R50 R52 R61 R64 R71 R72 = oresat-rcl:R-US_: RESISTOR, American symbol
R2 = R-Panasonic-EXB-2HV103JV:EXB-2HV103JV-LEGACY; BUILT_BY: EMA_UL_Team; DPN: Y1103CT-ND; MPN: EXB-2HV103JV; SOURCELIBRARY: Update_to_database_2020-12-03; VENDOR: Panasonic
R12-R14 = oresat-rcl:R-US_: RESISTOR, American symbol; DIS: Dgi-Key; DPN: 311-100MCT-ND; MFR: Yageo; MPN: RC0201FR-07100RL
R20 = R-Panasonic-EXB_A10PXXXJ:EXB-A10P391J; DPN: U7103CT-ND; MFR: Panasonic Electronic Components; MPN: EXB-A10P103J; MPN_GENERIC: EXB-A10PXXXJ
R27 = oresat-rcl:R-US_: RESISTOR, American symbol; DIS: Digi-Key; DPN: 541-3239-1-ND; MFR: Vishay; MPN: RCA0402100RFKEDHP
R33 R38 R42 R51 R53-R58 R65-R70 = oresat-rcl:R-US_: RESISTOR, American symbol; DIS: Digi-Key; DPN: 1276-4275-1-ND; MFR: Samsung; MPN: RC1005F6653CS
R63 = rcl:R-US_: RESISTOR, American symbol; SPICEPREFIX: R
TP1 TP16 TP18 TP27 TP39 = oresat-misc:TEST-POINT-LARGE-SQUARE
TP2 TP5 TP8 TP11 TP14 TP22-TP26 TP40-TP45 TP47 TP50-TP57 TP63 TP64 TP67 TP68 = oresat-misc:TEST-POINT_SMD: TEST POINT PAD; BOM: EXCLUDE
U1 = PIRT1280A1-12:PIRT1280A1-12: Footprint for the Princeton PIRT1280A1-12 SWIR Sensor
U2-U6 = U-Analog-LT3042-ultralow-noise-ldo:LT3042IMSE#TRPBF: Ldo, Adj, 0.2a, 0v-15v, Msop-10; DESCRIPTION: LDO Regulator Pos 0V to 15V 0.2A Automotive Medical 10-Pin MSOP EP T/R; DPN: LT3042IMSE#TRPBFCT-ND; MF: Analog Devices; MPN: LT3042IMSE#TRPBF; PACKAGE: MSOP -10 Analog Devices; PURCHASE-URL: https://pricing.snapeda.com/search/part/LT3042IMSE#TRPBF/?ref=eda
U7 = U-TI-TLC3704:TLC3704IPWR; DATASHEET_URL: http://www.ti.com/lit/gpn/LM2901-Q1; DESCRIPTION: Automotive Catalog Quad Differential Comparator; DPN: 296-18438-1-ND; FAMILY_NAME: COMPARATOR; GENERIC_PART_NUMBER: LM2901-Q1; INDUSTRY_STD_PKG_TYPE: TSSOP; MANUFACTURER: Texas Instruments; MPN: LM2901QPWRQ1; PACKAGE_DESIGNATOR: PW; PIN_COUNT: 14; VENDOR: Texas Instruments
U8 = U-TI-LP2985AIM5-3.3_NOPB-3.3V-Fixed-LDO:LP2985AIM5-3.3_NOPB: Micropower 150-mA Low-Noise Ultra-Low-Dropout Regulator in SOT-23 packages Source: Datasheet <http://www.ti.com/lit/ds/symlink/lp2985-n.pdf>; DESCRIPTION: Micropower 150-mA Low-Noise Ultra-Low-Dropout Regulator in SOT-23 packages; HEIGHT: 1.45mm; MANUFACTURER_NAME: Texas Instruments; MANUFACTURER_PART_NUMBER: LP2985AIM5-3.3/NOPB; MOUSER_PART_NUMBER: 926-2985AIM53.3/NOPB; MOUSER_PRICE-STOCK: https://www.mouser.com/Search/Refine.aspx?Keyword=926-2985AIM53.3%2FNOPB; RS_PART_NUMBER: 6520033P; RS_PRICE-STOCK: http://uk.rs-online.com/web/p/products/6520033P
U12 U13 = U-Microchip-MIC842-Comparator:MIC842L; DPN: 576-2927-1-ND; MPN: MIC842LYC5
U14 = U-Maxim-MAX4211-power-monitor:MAX4211; DPN: MAX4211FETE+-ND; MPN: MAX4211FETE+
U16 = U-Maxim-MAX7310-I2C-GPIO-expander:MAX7310; DPN: MAX7310ATE+-ND; MFR: Maxim; MPN: MAX7310ATE
U$1 = oresat-flight-marker:FLIGHMARKER
X1 = X-OSCILLATOR-GENERIC:OSC_GENERIC_2.5X2.0; DPN: 2780-ISM95-3251AH-16.000MHZCT-ND; MPN: ISM95-3251AH-16.000MHZ; VENDOR: Kyocera

## Net classes
1 diff pair: width 0.381 mm, clearance 0.508 mm to class 0, clearance 0.254 mm

## Board
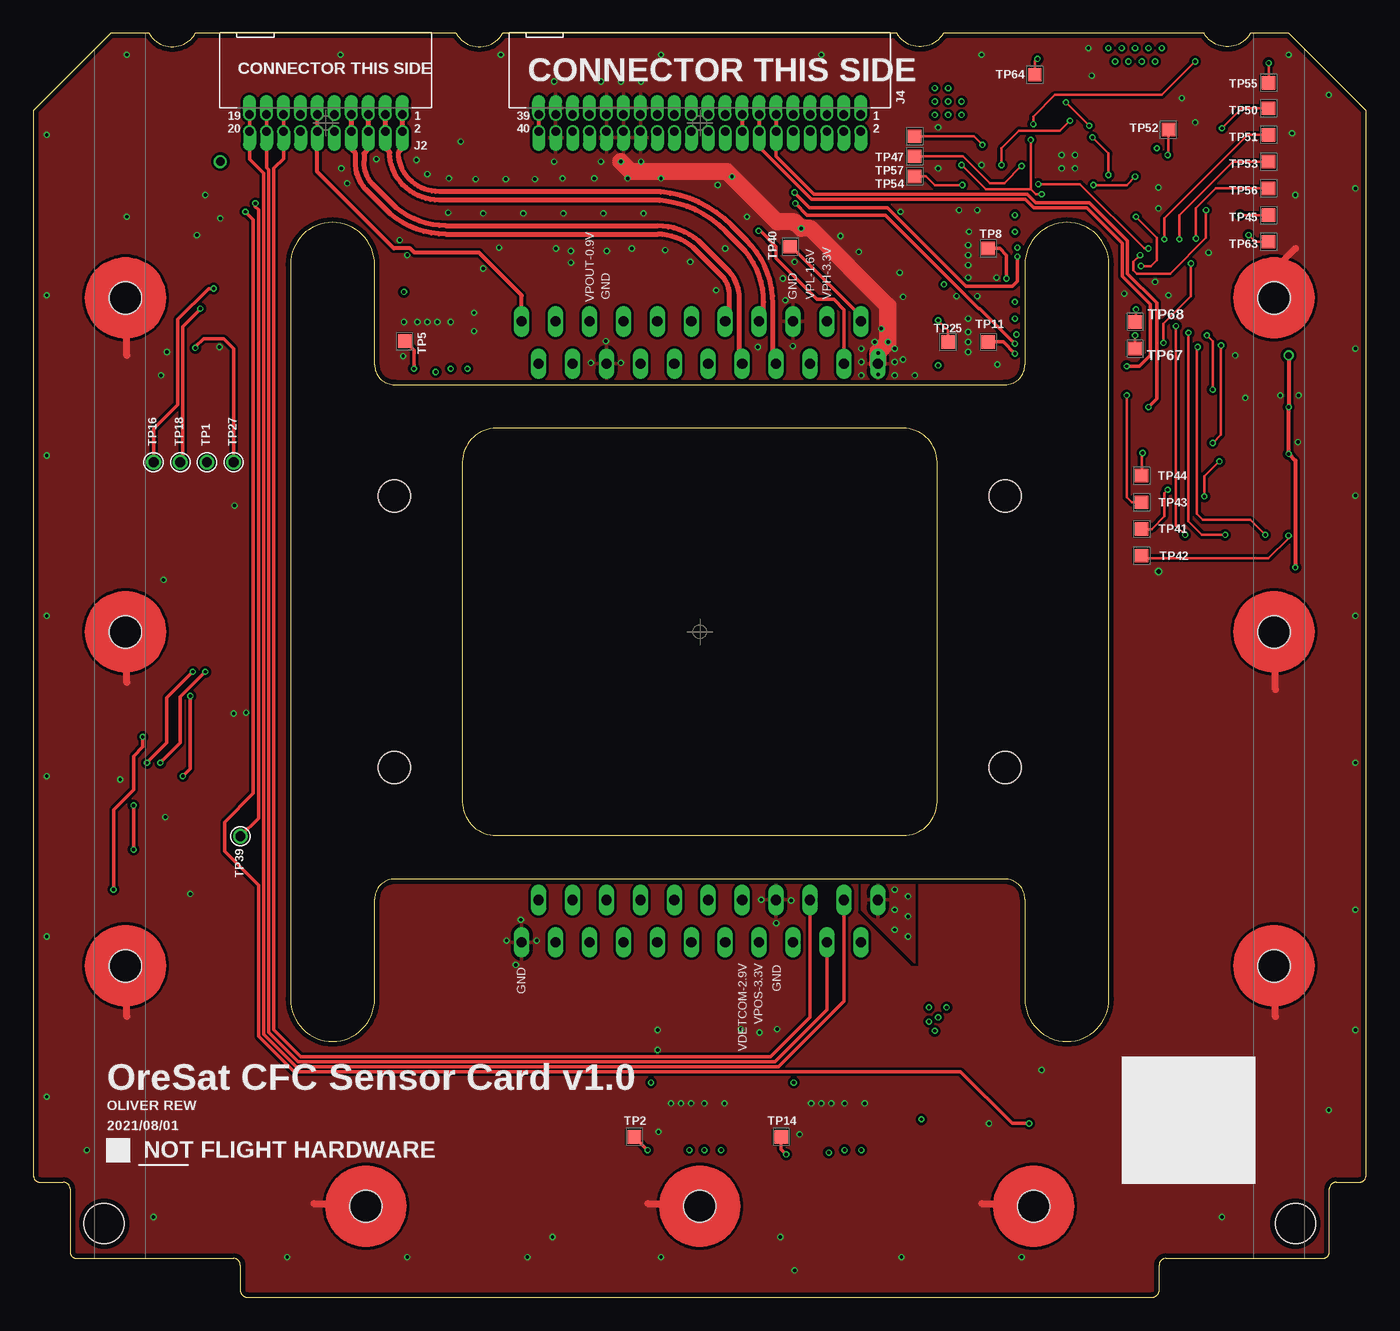
[diagram p5: board, top side]
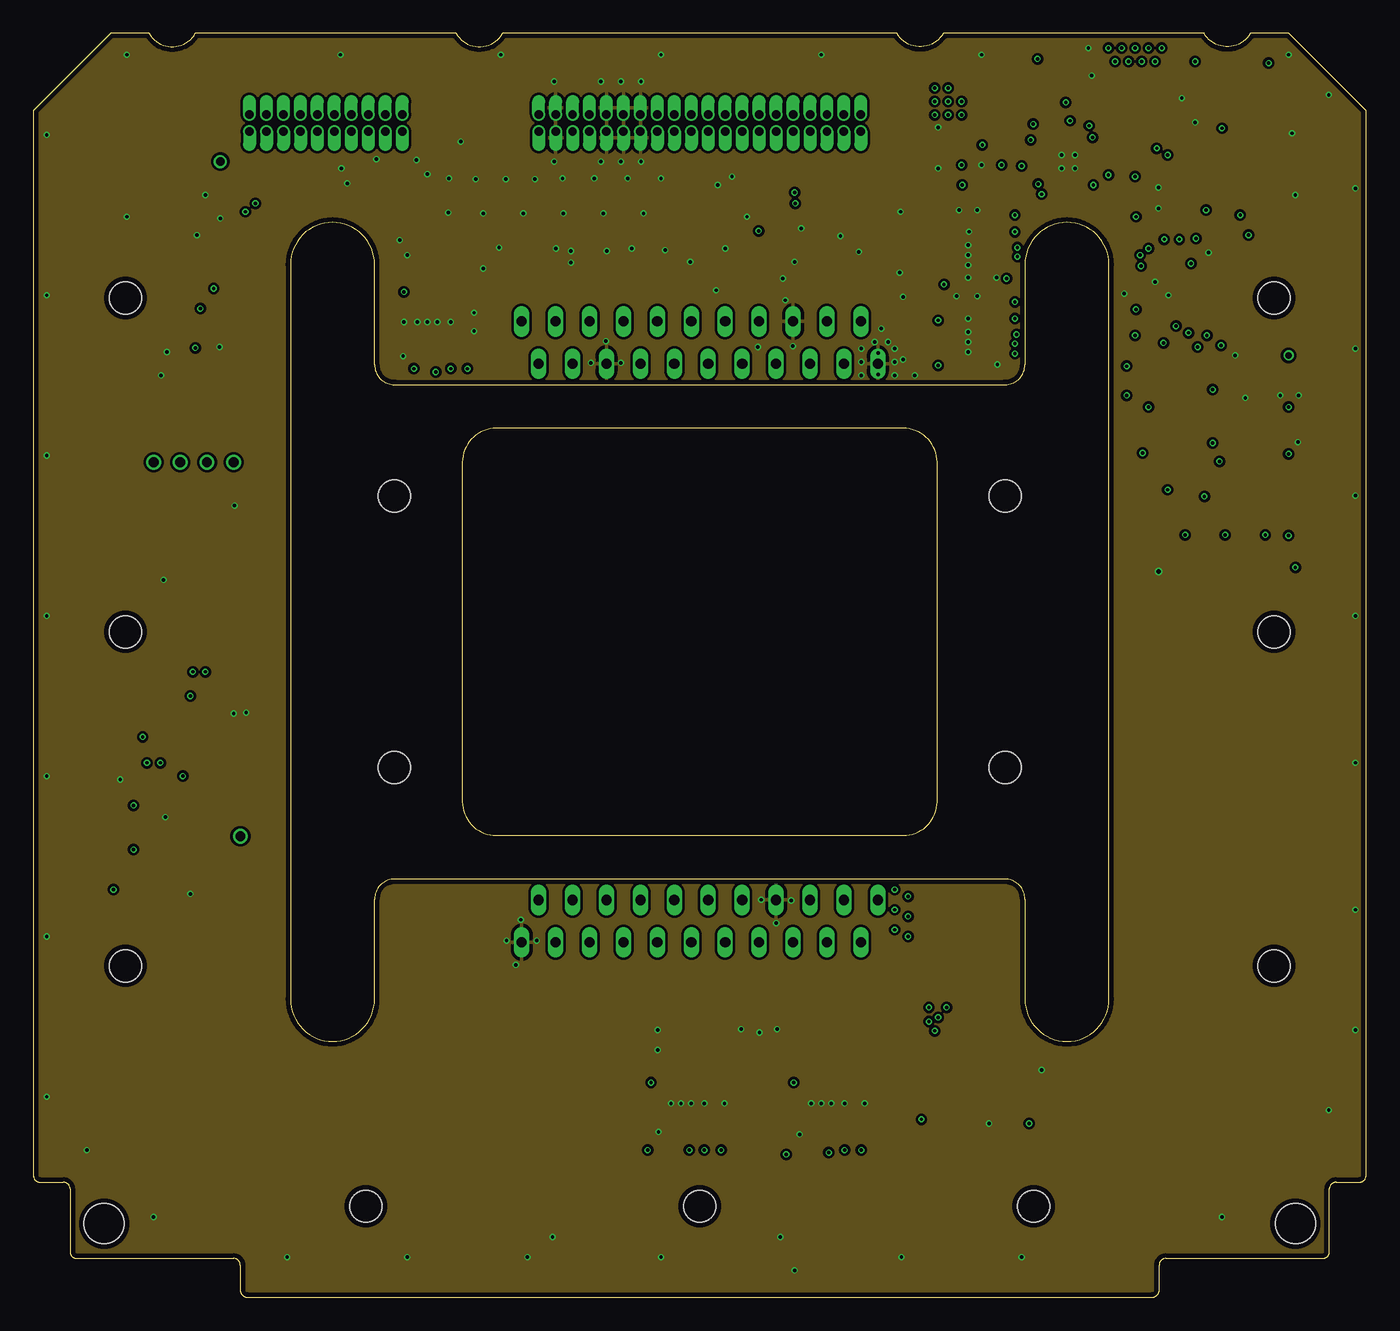
[diagram p6: board, inner layer Route2]
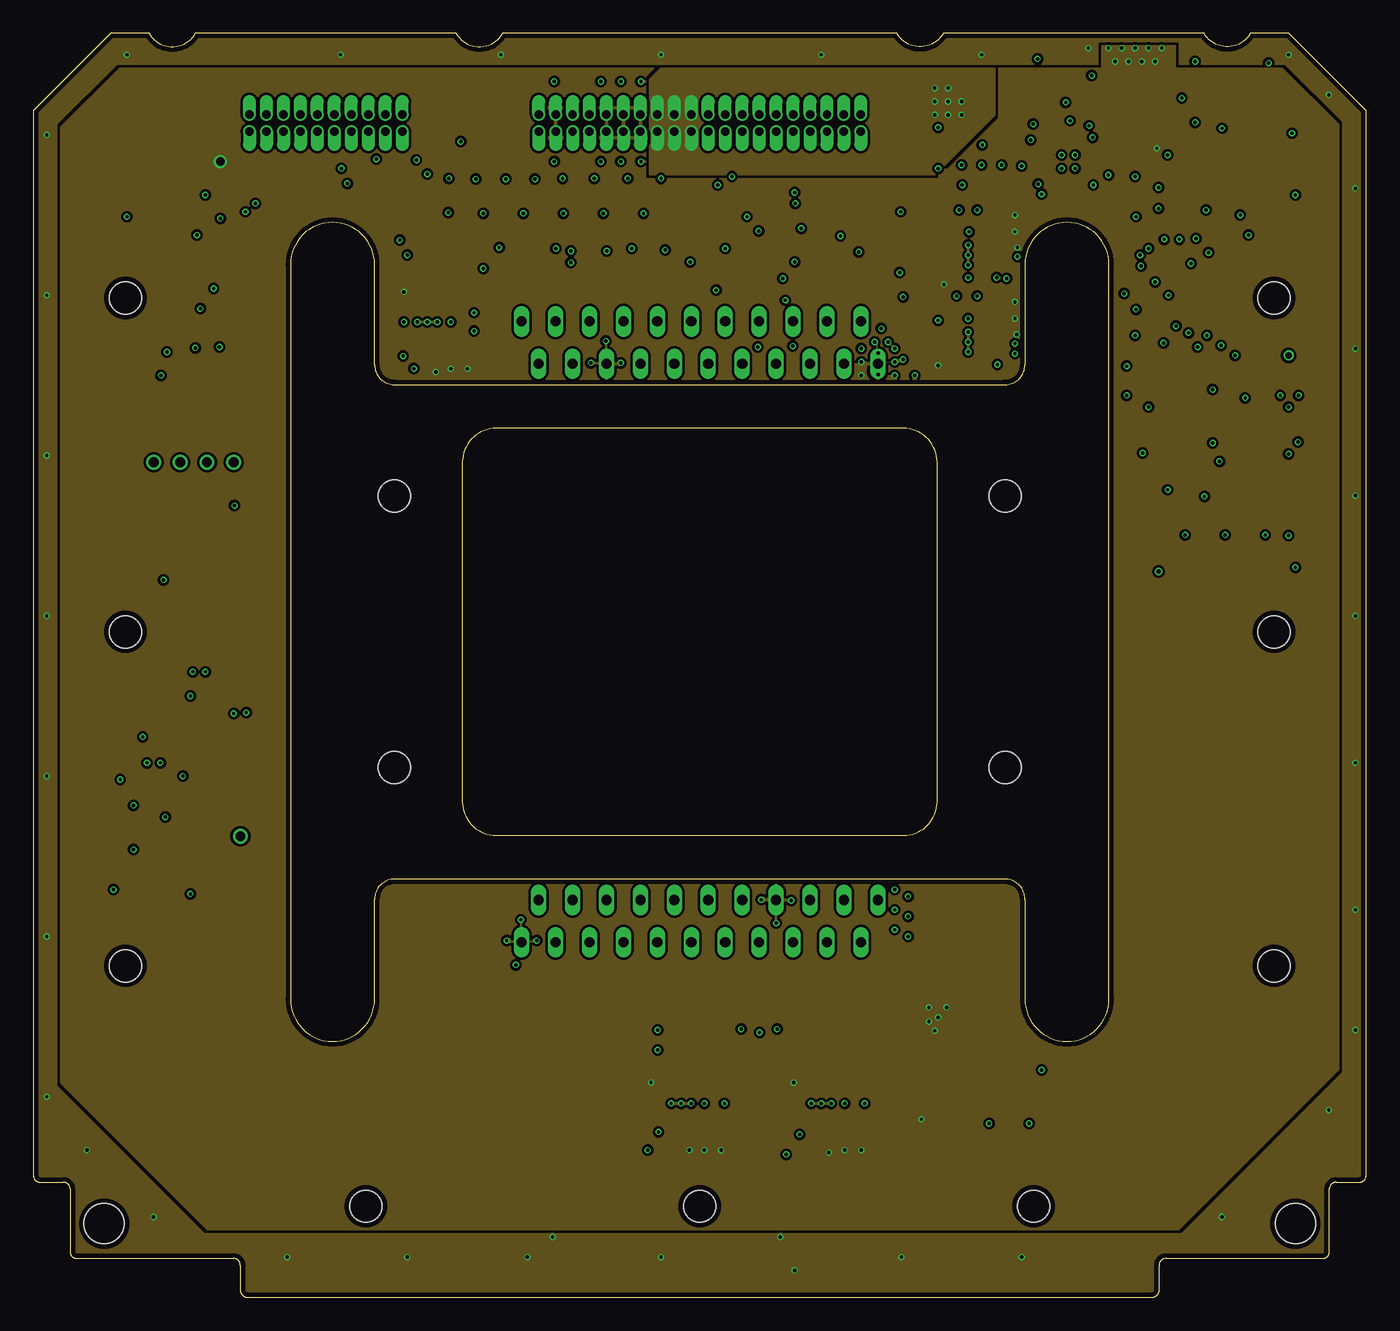
[diagram p7: board, inner layer Route15]
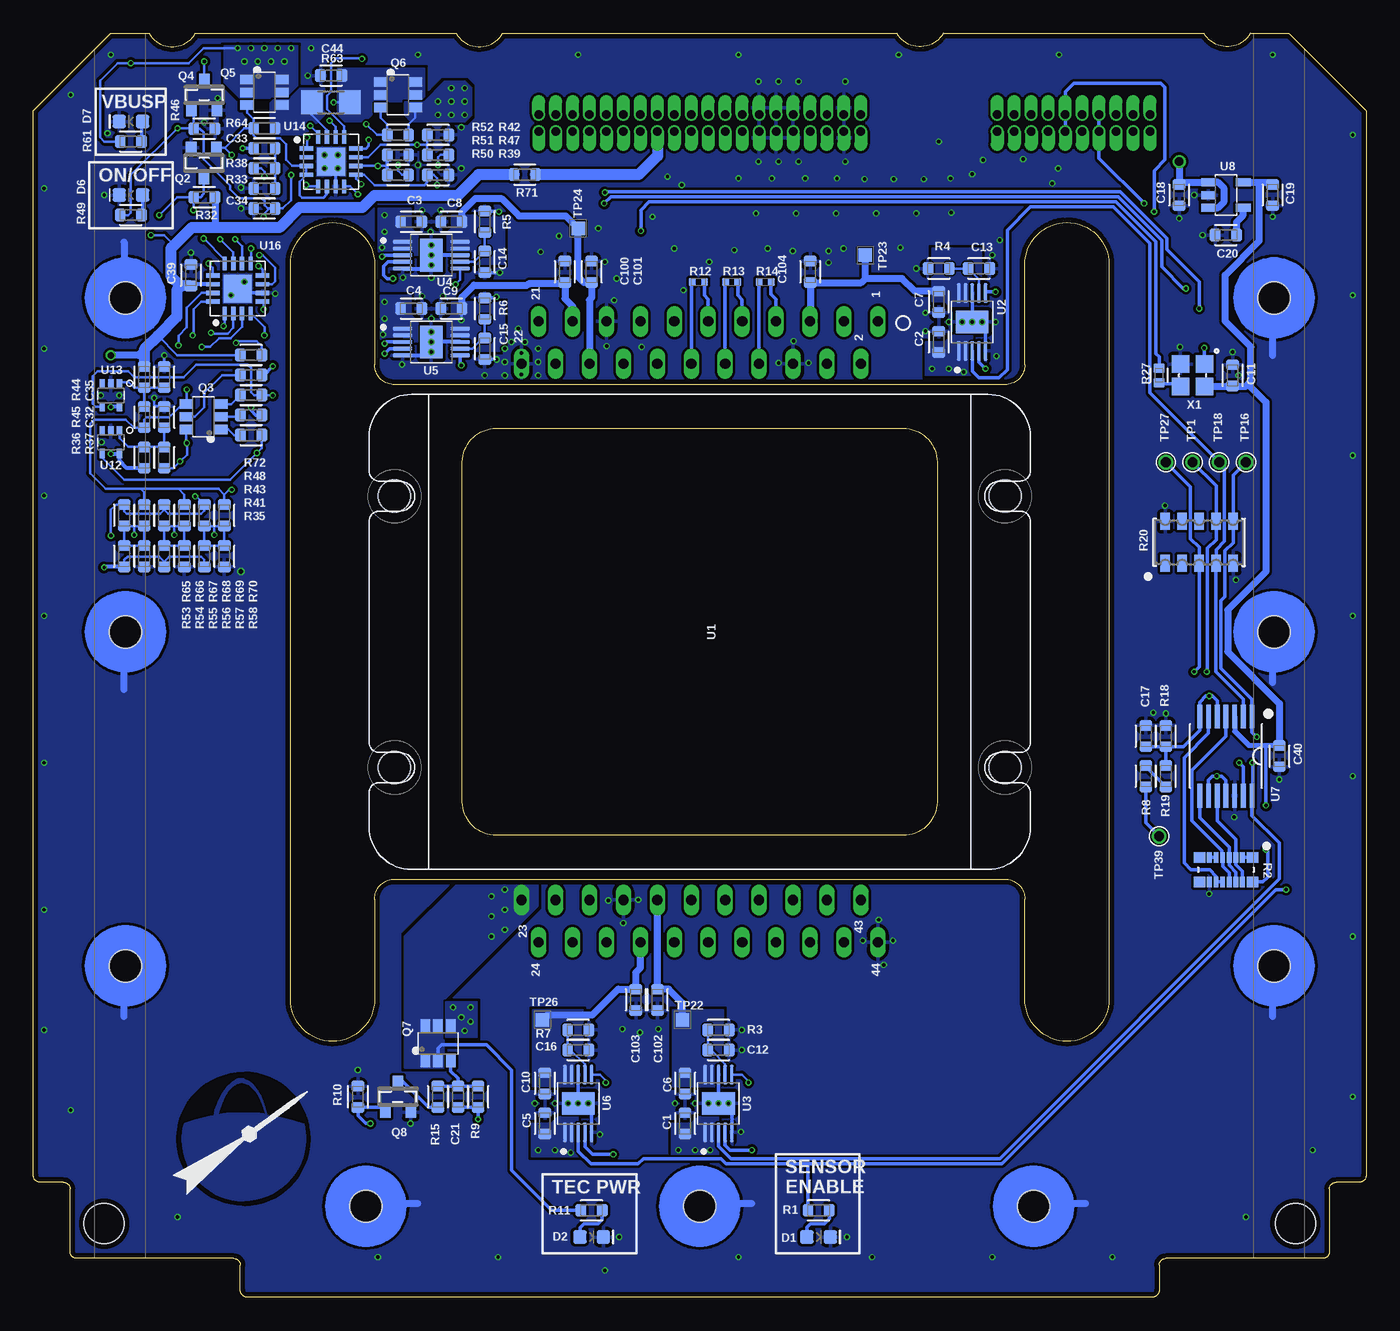
[diagram p8: board, bottom side, seen from below]

Size 99.8 x 94.6 mm. Coordinates in mm from the lower left corner, seen from the top.
Copper layers (1*2*15*16): Top 0.035559375mm / dielectric 0.17018125mm / Route2 0.01778125mm / dielectric 47mil / Route15 0.01778125mm / dielectric 0.17018125mm / Bottom 0.035559375mm
Design rules "4-layer_tented *": minimum track width 5mil, minimum drill 10mil, track to track 5mil, track to pad 5mil, pad to pad 5mil, via to via 5mil, smd to smd 5mil, copper to edge 15mil, drill to drill 6mil, minimum pad ring 4mil, minimum via ring 4mil, stop-mask expansion 2.5mil, vias tented up to drill 20mil, thermal gap 10mil

### Footprints (pad centres in the part's own frame; a part is rotated, then mirrored left to right if it is on the bottom)
.0603-B = smd 0.8 x 0.95: 1 -0.8,0; 2 0.8,0
LED-0603 = smd 1 x 1: A -0.877,0; C 0.877,0
J-SAMTEC-TFM-110-X1-XXX-D-RA = drill 0.635 pad 0.965 offset: 1 5.715,0.635; 2 5.715,-0.635; 3 4.445,0.635; 4 4.445,-0.635; 5 3.175,0.635; 6 3.175,-0.635; 7 1.905,0.635; 8 1.905,-0.635; 9 0.635,0.635; 10 0.635,-0.635; 11 -0.635,0.635; 12 -0.635,-0.635; 13 -1.905,0.635; 14 -1.905,-0.635; 15 -3.175,0.635; 16 -3.175,-0.635; 17 -4.445,0.635; 18 -4.445,-0.635; 19 -5.715,0.635; 20 -5.715,-0.635
J-SAMTEC-TFM-120-X1-XXX-D-RA = drill 0.635 pad 0.965 offset: 1 12.065,0.635; 2 12.065,-0.635; 3 10.795,0.635; 4 10.795,-0.635; 5 9.525,0.635; 6 9.525,-0.635; 7 8.255,0.635; 8 8.255,-0.635; 9 6.985,0.635; 10 6.985,-0.635; 11 5.715,0.635; 12 5.715,-0.635; 13 4.445,0.635; 14 4.445,-0.635; 15 3.175,0.635; 16 3.175,-0.635; 17 1.905,0.635; 18 1.905,-0.635; 19 0.635,0.635; 20 0.635,-0.635; 21 -0.635,0.635; 22 -0.635,-0.635; 23 -1.905,0.635; 24 -1.905,-0.635; 25 -3.175,0.635; 26 -3.175,-0.635; 27 -4.445,0.635; 28 -4.445,-0.635; 29 -5.715,0.635; 30 -5.715,-0.635; 31 -6.985,0.635; 32 -6.985,-0.635; 33 -8.255,0.635; 34 -8.255,-0.635; 35 -9.525,0.635; 36 -9.525,-0.635; 37 -10.795,0.635; 38 -10.795,-0.635; 39 -12.065,0.635; 40 -12.065,-0.635
ORESAT-CARD-V1.3-CFC = hole 3: 94.5,5.5; 5.3,5.5 | hole 2.4: 6.9,74.8; 6.9,49.8; 6.9,24.8; 24.9,6.8; 49.9,6.8; 74.9,6.8; 92.9,24.8; 92.9,49.8; 92.9,74.8
SOT23 = smd 0.787 x 0.889: 1 -0.953,-1.143; 2 0.953,-1.143; 3 0,1.143
SOT23-6 = smd 0.7 x 1: 1 -0.95,-1.3; 2 0,-1.3; 3 0.95,-1.3; 4 0.95,1.3; 5 0,1.3; 6 -0.95,1.3
RES_EXB2HV = smd 0.787 x 0.864: 1 -0.914,1.981; 8 -0.914,-1.981; 9 0.914,-1.981; 16 0.914,1.981 | smd 0.787 x 0.356: 2 -0.914,1.234; 3 -0.914,0.74; 4 -0.914,0.247; 5 -0.914,-0.247; 6 -0.914,-0.74; 7 -0.914,-1.234; 10 0.914,-1.234; 11 0.914,-0.74; 12 0.914,-0.247; 13 0.914,0.247; 14 0.914,0.74; 15 0.914,1.234
.0402-C-NOSILK = smd 0.5 x 0.6: 1 -0.45,0; 2 0.45,0
ARRAY_EXBA-M = smd 1.27 x 0.711: 1 -1.575,2.54; 2 -1.575,1.27; 3 -1.575,0; 4 -1.575,-1.27; 5 -1.575,-2.54; 6 1.575,-2.54; 7 1.575,-1.27; 8 1.575,0; 9 1.575,1.27; 10 1.575,2.54
.0402-A = smd 0.7 x 0.8: 1 -0.55,0; 2 0.55,0
R1206 = smd 1.6 x 1.803: 1 -1.422,0; 2 1.422,0
1X01 = drill 0.737 pad 1.1: 1 0,0
TESTPOINT_SMD-10SN = smd 1 x 1: TP 0,0
PIRT1280A1-12 = drill 0.762 long: 1 -23.241,13.335; 2 -20.066,12.065; 3 -23.241,10.795; 4 -20.066,9.525; 5 -23.241,8.255; 6 -20.066,6.985; 7 -23.241,5.715; 8 -20.066,4.445; 9 -23.241,3.175; 10 -20.066,1.905; 11 -23.241,0.635; 12 -20.066,-0.635; 13 -23.241,-1.905; 14 -20.066,-3.175; 15 -23.241,-4.445; 16 -20.066,-5.715; 17 -23.241,-6.985; 18 -20.066,-8.255; 19 -23.241,-9.525; 20 -20.066,-10.795; 21 -23.241,-12.065; 22 -20.066,-13.335; 23 20.066,-13.335; 24 23.241,-12.065; 25 20.066,-10.795; 26 23.241,-9.525; 27 20.066,-8.255; 28 23.241,-6.985; 29 20.066,-5.715; 30 23.241,-4.445; 31 20.066,-3.175; 32 23.241,-1.905; 33 20.066,-0.635; 34 23.241,0.635; 35 20.066,1.905; 36 23.241,3.175; 37 20.066,4.445; 38 23.241,5.715; 39 20.066,6.985; 40 23.241,8.255; 41 20.066,9.525; 42 23.241,10.795; 43 20.066,12.065; 44 23.241,13.335 | hole 2.4: -10.16,22.86; 10.16,22.86; 10.16,-22.86; -10.16,-22.86
SOP50P490X110-11N = smd 1.45 x 0.28: 1 -2.16,1; 2 -2.16,0.5; 3 -2.16,0; 4 -2.16,-0.5; 5 -2.16,-1; 6 2.16,-1; 7 2.16,-0.5; 8 2.16,0; 9 2.16,0.5; 10 2.16,1 | smd 1.68 x 2.46: 11 0,0
14-TSSOP = smd 1.778 x 0.356: 1 -2.972,1.95; 2 -2.972,1.3; 3 -2.972,0.65; 4 -2.972,0; 5 -2.972,-0.65; 6 -2.972,-1.3; 7 -2.972,-1.95; 8 2.972,-1.95; 9 2.972,-1.3; 10 2.972,-0.65; 11 2.972,0; 12 2.972,0.65; 13 2.972,1.3; 14 2.972,1.95
SOT-23 = smd 1.1 x 0.6: 1 -1.3,0.95; 2 -1.3,0; 3 -1.3,-0.95; 4 1.3,-0.95; 5 1.3,0.95
SC70-5 = smd 0.4 x 0.7: 1 -0.65,-0.85; 2 0,-0.85; 3 0.65,-0.85; 4 0.65,0.85; 5 -0.65,0.85
QFN65P400X400X80-17T210 = smd 1.01 x 0.32: 1 -1.86,0.975; 2 -1.86,0.325; 3 -1.86,-0.325; 4 -1.86,-0.975; 9 1.86,-0.975; 10 1.86,-0.325; 11 1.86,0.325; 12 1.86,0.975 | smd 0.32 x 1.01: 5 -0.975,-1.86; 6 -0.325,-1.86; 7 0.325,-1.86; 8 0.975,-1.86; 13 0.975,1.86; 14 0.325,1.86; 15 -0.325,1.86; 16 -0.975,1.86 | smd 2.1 x 2.1: EPAD 0,0
OSC_2.5X2.0 = smd 1.3 x 1.3: 1 -0.9,-0.84; 2 0.9,-0.84; 3 0.9,0.84; 4 -0.9,0.84

### Placement (x,y rotation side)
C1  51,13 90 bottom
C2  32,71.5 90 bottom
C3  71.5,80.5 0 bottom
C4  71.5,74 0 bottom
C5  61.5,13 90 bottom
C6  51,16 270 bottom
C7  32,74.5 270 bottom
C8  68.5,80.5 180 bottom
C9  68.5,74 180 bottom
C10  61.5,16 270 bottom
C11  10,69 90 bottom
C12  48.5,18.5 0 bottom
C13  29,77 0 bottom
C14  66,77.5 270 bottom
C15  66,71 270 bottom
C16  59,18.5 0 bottom
C17  16.5,42 90 bottom
C18  14,82.5 270 bottom
C19  7,82.5 270 bottom
C20  10.5,79.5 180 bottom
C21  68,15 90 bottom
C32  90,65.88 90 bottom
C33  82.5,86 180 bottom
C34  82.5,81.5 180 bottom
C35  90,68.88 90 bottom
C39  88,76.5 270 bottom
C40  6.5,40.5 270 bottom
C44  77.5,91.44 180 bottom
C100  60,76.75 90 bottom
C101  58,76.75 90 bottom
C102  53.06,22.25 270 bottom
C103  54.69,22.25 270 bottom
C104  41.62,76.75 90 bottom
D1  41,4.5 0 bottom
D2  58,4.5 0 bottom
D6  92.5,82.5 180 bottom
D7  92.5,88 180 bottom
J2  21.9,87.9 0 top
J4  49.9,87.9 0 top
PCB1  0,0 0 top
Q2  87.03,84.9 180 bottom
Q3  87.06,65.9 90 bottom
Q4  87,90 0 bottom
Q5  82.5,90.19 270 bottom
Q6  72.5,90 270 bottom
Q7  69.5,19 0 bottom
Q8  72.5,15 0 bottom
R1  41,6.5 180 bottom
R2  10.5,32 270 bottom
R3  48.5,20 180 bottom
R4  32,77 0 bottom
R5  66,80.5 270 bottom
R6  66,74 270 bottom
R7  59,20 180 bottom
R8  16.5,39 90 bottom
R9  66.5,15 270 bottom
R10  75.5,15 270 bottom
R11  58,6.5 180 bottom
R12  50,76 0 bottom
R13  47.5,76 0 bottom
R14  45,76 0 bottom
R15  69.5,15 90 bottom
R18  15,42 270 bottom
R19  15,39 90 bottom
R20  12.5,56.5 90 bottom
R27  15.5,69 90 bottom
R32  87,82.34 0 bottom
R33  82.5,83 0 bottom
R35  83.5,64.53 180 bottom
R36  91.5,62.85 270 bottom
R37  90,62.85 270 bottom
R38  82.5,84.5 0 bottom
R39  69.5,84 180 bottom
R41  83.5,66.03 180 bottom
R42  69.5,87 180 bottom
R43  83.5,67.53 180 bottom
R44  91.5,68.88 90 bottom
R45  91.5,65.88 270 bottom
R46  87,87.46 180 bottom
R47  69.5,85.5 0 bottom
R48  83.5,69.03 180 bottom
R49  92.5,81 180 bottom
R50  72.5,84 0 bottom
R51  72.5,85.5 180 bottom
R52  72.5,87 0 bottom
R53  93,55.46 270 bottom
R54  91.5,55.46 90 bottom
R55  90,55.46 270 bottom
R56  88.5,55.46 90 bottom
R57  87,55.46 270 bottom
R58  85.5,55.46 90 bottom
R61  92.5,86.5 180 bottom
R63  77.53,89.44 180 bottom
R64  82.5,87.5 0 bottom
R65  93,58.52 270 bottom
R66  91.5,58.52 90 bottom
R67  90,58.52 270 bottom
R68  88.5,58.52 90 bottom
R69  87,58.52 270 bottom
R70  85.5,58.52 90 bottom
R71  63,84.03 180 bottom
R72  83.5,70.53 180 bottom
TP1  13,62.5 90 top
TP2  45,12 90 top
TP5  27.81,71.56 90 top
TP8  71.5,78.5 0 top
TP11  71.5,71.5 0 top
TP14  56,12 90 top
TP16  9,62.5 90 top
TP18  11,62.5 90 top
TP22  51.19,20.75 0 bottom
TP23  37.5,78 270 bottom
TP24  59,80 0 bottom
TP25  68.5,71.5 0 top
TP26  61.69,20.75 0 bottom
TP27  15,62.5 90 top
TP39  15.5,34.5 270 bottom
TP40  56.69,78.62 0 top
TP41  83,57.5 0 top
TP42  83,55.5 0 top
TP43  83,59.5 0 top
TP44  83,61.5 0 top
TP45  92.5,81 0 top
TP47  66,86.9 0 top
TP50  92.5,89 0 top
TP51  92.5,87 0 top
TP52  85,87.4 0 top
TP53  92.5,85 0 top
TP54  66,83.9 0 top
TP55  92.5,90.9 0 top
TP56  92.5,83 0 top
TP57  66,85.4 0 top
TP63  92.5,79 0 top
TP64  75,91.5 0 top
TP67  82.5,71 0 top
TP68  82.5,73 0 top
U1  49.9,49.8 270 bottom
U2  29.5,73 90 bottom
U3  48.5,14.5 90 bottom
U4  70,78 0 bottom
U5  70,71.5 0 bottom
U6  59,14.5 90 bottom
U7  10.5,40.5 270 bottom
U8  10.5,82.5 0 bottom
U12  94,64 180 bottom
U13  94,67.5 180 bottom
U14  77.5,85 0 bottom
U16  84.5,75.5 90 bottom
U$1  5.7,10.4 0 top
U$2  [ORESAT_ORIENTATION_COPPER]  89,39 0 top
U$3  [PSAS_LOGO_10X10]  84,11.9 0 bottom
X1  13,69 180 bottom

### Tracks (layer width: path | path; a pad name or v marks a point on that pad's centre or on a via)
3.3V  (via drill 0.25)
  Top 0.254: v7.5,33.5 v7.5,36.81
  Bottom 0.254: R2.16 7.73,31.09 7.38,31.44 7.38,33.38 v7.5,33.5 | v7.5,36.81 7.5,41.24 7.44,41.3
  Bottom 0.381: U7.3 9.85,42.35 8.8,41.3 7.44,41.3 C40.1
  Bottom 0.508: U8.5 8,83.45 | 8,83.45 7.15,83.45 C19.1 | X1.4 12.06,68.2 C11.1 8.99,68.2 8.84,68.34 | 8.84,68.34 8.62,68.56 8.62,71.12 10.56,73.06 10.56,76.5 8,79.06 8,83.45 | 8.84,68.34 7.5,67 7.5,54.31 10.38,51.44 10.38,48.31 6.5,44.44 C40.1
!FAULT  (via drill 0.25)
  Top 0.203: v87.81,81.38 87.81,79.31 85.12,76.62 82.62,76.62 82.38,76.88 82.38,77.5 v82.88,78 | TP45.TP v90.38,81
  Bottom 0.203: R32.1 87.81,82.33 v87.81,81.38 | R32.1 87.29,82.34 87.03,82.59 Q2.3 | U16.7 81.92,75.83 81.69,76.06 81.69,77.06 82.62,78 v82.88,78 | R32.1 89.04,82.34 v90.38,81
!SD
  Top 0.305: J4.39 J4.40
AD0  (via drill 0.25)
  Top 0.203: v85.56,72.69 85.56,57.75 v86.25,57.06
  Bottom 0.203: 86.25,57.73 R69.2 R57.1 R58.2 R70.1 86.25,57.73 | U16.1 85.47,72.78 v85.56,72.69 | v86.25,57.06 86.25,57.73
AD1  (via drill 0.25)
  Top 0.203: v86.5,72.19 86.5,58.06 87.5,57.06 v89.25,57.06
  Bottom 0.203: 89.25,57.73 R67.2 R55.1 R56.2 R68.1 89.25,57.73 | U16.2 84.83,72.55 85.25,72.12 86.44,72.12 v86.5,72.19 | v89.25,57.06 89.25,57.73
AD2  (via drill 0.25)
  Top 0.203: v87.19,71.12 87.12,71.06 87.12,58.62 87.56,58.19 91.12,58.19 v92.25,57.06
  Bottom 0.203: 92.25,57.73 R66.1 R54.2 R53.1 R65.2 92.25,57.73 | U16.3 84.17,72.64 85.02,71.8 85.89,71.8 86.56,71.12 v87.19,71.12 | v92.25,57.06 92.25,57.73
BOOT0  (via drill 0.25)
  Top 0.203: v84.69,79.19 84.69,80.75 90.94,87 TP51.TP
  Bottom 0.203: U16.10 84.17,78.67 v84.69,79.19
CB-RESET  (via drill 0.25)
  Top 0.203: v75.25,83.31 78.38,83.31 83.19,78.5 v83.5,78.5 | TP54.TP 66.85,83.9 67.5,83.25 v69.56,83.25
  Bottom 0.203: v75.25,83.31 75.64,83.7 U14.9 75.03,84.03 74.25,83.25 70.5,83.25 70.3,83.45 R39.2 69.81,84 69.56,83.75 v69.56,83.25 | U16.9 83.5,77.39 v83.5,78.5
CB_CTRL  (via drill 0.25)
  Top 0.203: TP52.TP 85,85.56 v84.94,85.5
  Bottom 0.203: R64.1 83.3,86.99 83.06,86.75 81.31,86.75 80.88,86.31 80.88,85.12 80.42,84.67 U14.3 U14.4 79.88,83.51 79.88,82.5 79.69,82.31 78.06,82.31 77.83,82.55 U14.6 | R64.1 84,87.5 85.46,86.04 Q2.1 85.48,86.04 v84.94,85.5 | Q5.3 83.8,88.67 83.3,88.17 R64.1
GND  (via drill 0.25, 0.35)
  Top 0.508: 7,70.5 7,72.5 | 7,46 7,47.5 | 7,21 7,22.5 | 21,7 22.5,7 | 71,7 72.5,7 | 93,21 93,22.5 | 93,45.5 93,47.5 | 94.5,78.5 93,77 | 46,7 48,7
  Top 1.27: U1.22 63.23,70.73 v64,71.5 64,74.19 58.19,80 v57.5,80 57,80.5 55.69,80.5 v52.31,83.88 51.94,84.25 44.75,84.25 v44,85
  Bottom 0.203: U14.7 77.17,84.33 v77,84.5 | C32.2 90.61,66.67 90.75,66.81 v90.75,67.31 | C35.2 v90,70.5
  Bottom 0.254: U6.8 U6.11 | U3.8 U3.11 | U3.5 47.5,14.25 v47.75,14.5 | U6.5 58,14.25 v58.25,14.5 | U2.8 U2.11 | U2.5 28.5,72.75 v28.75,73 | R6.1 65.2,74.8 v65.12,74.88 | C14.2 v64.89,76.7 v64.88,76.69 | R5.1 64.99,81.3 v64.94,81.25 | C15.2 65.14,70.2 v65.12,70.19 | U16.6 84.17,75.17 U16.EPAD v84,76
  Bottom 0.305: U5.8 U5.11 | U4.8 U4.11 | U4.5 70.25,77 v70,77.25 | U5.5 70.25,70.5 v70,70.75
  Bottom 0.508: 7,70.5 7,72.5 | 93,79 93,77 | 93,45.5 93,47.5 | 93,21 93,22.5 | 71,7 72.5,7 | 46,7 48,7 | 21,7 22.5,7 | 7,21 7,22.5 | 7,46 7,47.5
  other vias: 70,71.5 70,72.25 59,14.5 59.75,14.5 29.5,73 30.25,73 70,78 70,78.75 48.5,14.5 49.25,14.5 70,73.25 69.12,74.94 70.69,74.94 72.19,69.81 70.06,79.75 69.31,81.38 70.69,81.38 72.12,76.31 70,76.31 31.25,73 33,73.69 33,72.31 27.75,73 27.69,70.44 28,78 33.69,77 64.5,69 64.5,70 64.5,71 63,71.5 62,71 62,70 62,69 63.5,72.5 63.25,70.69 63.25,69.06 66,69 32,86.5 6.5,38.75 67.75,84.5 67.75,87.56 71,84.75 77,85.5 78,85.5 78,84.5 84.25,83.06 84.25,81.5 86,89.75 79.25,91.44 93.38,67.5 94.75,67.5 94.69,64 88,78.19 94.5,82.5 94.25,87.12 46.75,20 46.75,18.5 50.25,14.5 51.75,14.5 60.75,14.5 62.25,14.5 57.38,12.19 46.81,12.38 12.88,82.5 14,80.75 12.25,79.5 7,80.88 10,70.75 9.56,69 13.94,71.12 42.94,78.31 40.25,78.31 40.25,77.44 60.44,79.44 61.81,78.25 9.88,35.94 15,43.69 15.94,43.75 15.06,59.25 9.75,53.69 38.88,4.5 55.94,4.5 71.56,13 45.5,91 44,91 42.5,91 42.5,85 45.5,85 39,85 39,91 54.38,19.81 53,20.06 55.69,20.06 84.25,54.31 11.75,30.19 42.88,71.56 41.75,69.94 44,69.94 56.31,74.62 56.88,71.19 56.12,76.25 81.69,75.12 85,75 87,87.94 56.75,29.69 54.5,29.75 55.62,28 35.44,26.69 37.69,26.69 36.5,28.25 36.12,24.88 51.12,75.38 49.19,77.5 47.31,78.38 44.81,78.5 39.12,78.5 34.88,78.56 27.44,79.12 23.5,83.38 23.06,84.5 25.69,85.19 28.69,85.12 29.5,84.06 31.12,83.75 33.12,83.69 35.38,83.69 37.56,83.69 39.62,83.75 42,83.75 44.5,83.75 47,83.75 51.25,83.25 53.44,80.88 51.81,78.5 45.69,81.12 42.69,81.12 39.69,81.12 36.69,81.12 33.69,81.12 31.06,81.19 54.25,71.12 7,93 1,87 1,75 1,63 1,51 1,39 1,27 1,15 23,93 35,93 47,93 59,93 71,93 4,11 9,6 19,3 28,3 37,3 47,3 57,2 65,3 74,3 89,6 97,14 99,20 99,29 99,40 99,51 99,60 99,71 99,83 97,90 79,93.5 94,93 75.5,17 57,77.5
  pour Route15 (isolate 0.2, rank 6): -1.5,-1.5 102.5,-1.5 102.5,96.2 -1.5,96.2
  pour Top (isolate 0.2, rank 6): -0.5,-0.5 101.5,-0.5 101.5,95.2 -0.5,95.2
  pour Bottom (isolate 0.2, rank 6): 0,0 101,0 101,94.9 0,94.9
  pour Route2 (isolate 0.2, rank 6): -1,-1 102,-1 102,95.7 -1,95.7
  pour Bottom: 77.5,15.4 77.5,8.9 80.5,5.9 87,5.9 90,8.9 90,15.4 87.5,17.9 80,17.9
IOUT  (via drill 0.25)
  Top 0.203: v72.5,84.75 72.5,86 73.81,87.31 76.88,87.31 v77.62,88.06
  Bottom 0.203: v72.5,84.75 72.5,84.3 72.2,84 R50.2 | U14.14 77.17,87.61 v77.62,88.06
N$1  (via drill 0.25)
  Top 0.254: v57.06,81.88 57.94,81 63.81,81 70.81,74 70.88,74 v73.5,71.38 | TP16.1 9,65 10.81,66.81 10.81,73.19 13.12,75.5 v13.5,75.5 | v8.19,41.94 8.19,41.19 7.5,40.5 7.5,38 6,36.5 v6,30.5
  Bottom 0.254: TP16.1 9.96,61.54 R20.6 9.96,56.48 10.57,55.87 10.57,52.43 10.88,52.12 10.88,47.07 8.55,44.74 U7.1 8.55,42.3 v8.19,41.94 | 41.81,9.99 27.28,9.99 6.77,30.5 v6,30.5 | U6.3 59,10.94 58.06,9.99 54.51,9.99 54.12,10.38 48.31,10.38 47.93,9.99 41.81,9.99 | v57.06,81.88 56.56,82.38 18.57,82.38 15.31,79.12 15.31,77.12 13.69,75.5 v13.5,75.5 | U5.3 73.38,71.5 v73.5,71.38 | R1.2 41.8,9.98 41.81,9.99
N$2
  Bottom 0.254: R19.1 16.5,39.7 R8.2
N$3
  Bottom 0.254: 68,16 C21.2 R9.1 | 68,16 68,16.38 68.55,16.93 Q7.3 | R15.2 68.2,15.8 68,16
N$4
  Bottom 0.254: R2.2 R2.1
N$5
  Bottom 0.254: U7.10 11.15,35.65 9.76,34.26 R2.3 9.76,32.38 9.27,31.89 R2.15
N$6
  Bottom 0.254: R2.14 9.76,31.82 10.25,32.32 R2.4 10.25,33.69 12.45,35.89 U7.8
N$7
  Bottom 0.254: R2.13 10.25,31.75 10.75,32.25 R2.5 10.81,32.98 10.81,33.41 13.06,35.67 13.06,39.44 10.5,42 U7.4
N$8
  Bottom 0.254: R2.6 R2.7
N$9  (via drill 0.25)
  Top 0.254: v11.19,39 11.75,39.56 v11.75,45
  Bottom 0.254: U7.9 11.8,38.7 11.5,39 v11.19,39 10.81,39 10.5,38.69 U7.11 | U7.5 11.15,44.65 11.5,45 v11.75,45 12,45 12.45,44.55 U7.7 12.45,42.42 13.68,41.2 R18.2 | R18.2 C17.1 | R19.2 R18.2
N$10  (via drill 0.25)
  Top 0.254: v8.5,40 10,41.5 10,44.88 v11.94,46.81
  Bottom 0.254: v8.5,40 8.5,37.58 U7.14 8.55,36.05 6.5,34 6.5,31.31 27.44,10.38 47.56,10.38 48.5,11.31 U3.3 | v11.94,46.81 11.88,46.88 11.88,56.06 11.23,56.71 R20.7 11.23,60.73 TP1.1
N$11
  Bottom 0.254: U1.11 49.27,74.72 49.55,75 R12.2
N$12
  Bottom 0.254: R11.1 57.2,5.8 57.5,5.5 58.56,5.5 58.88,5.19 D2.A
N$13
  Bottom 0.254: R1.1 40.2,5.86 40.56,5.5 41.62,5.5 41.88,5.25 D1.A
N$14
  Bottom 0.254: X1.3 14.12,68.38 15.43,68.38 R27.1
N$15  (via drill 0.25)
  Top 0.254: TP5.TP 28.5,70.88 v28.5,69.5
  Bottom 0.254: U2.4 29,70 v28.5,69.5
N$16
  Top 0.254: U1.21 61.97,73.41 56.75,78.62 TP40.TP
N$17  (via drill 0.25)
  Top 0.254: v54.31,79.81 54.44,79.81 55.62,78.62 55.62,77.75 58.69,74.69 59.94,74.69 60.7,73.93 U1.20
  Bottom 0.254: R27.2 15.5,70.39 15.75,70.64 15.75,79 18.75,82 53.69,82 54.31,81.38 v54.31,79.81
N$18
  Bottom 0.508: C20.1 9.7,80.49 9.2,80.99 U8.4
N$19
  Bottom 0.254: U1.12 50.53,75.92 R12.1
N$20
  Bottom 0.2: U2.7 29,76.2 C13.1 R4.2
N$21
  Bottom 0.254: U1.9 46.73,74.67 47.05,75 R13.2
N$22
  Bottom 0.254: U1.10 47.99,75.95 R13.1
N$23  (via drill 0.25)
  Top 0.254: v46,11 TP2.TP
  Bottom 0.254: U3.4 48,11.35 47.65,11 v46,11
N$24
  Bottom 0.2: U3.7 48,17.44 49,18.44 49.24,18.44 C12.1 R3.2
N$25
  Bottom 0.203: C32.1 R37.1 R36.1 92.71,63.65 93.35,64.29 U12.1
N$26
  Bottom 0.254: U1.7 44.19,74.7 44.55,75.06 R14.2
N$27  (via drill 0.25)
  Top 0.203: TP44.TP 83,63.12 v83.06,63.19
  Bottom 0.203: U12.4 94.65,62.84 93,61.19 85.06,61.19 v83.06,63.19 82.7,63.55 R35.1
N$28  (via drill 0.25)
  Top 0.254: TP14.TP 56,11.06 v56.38,10.69
  Bottom 0.254: U6.4 58.5,11.25 57.94,10.69 v56.38,10.69
N$29
  Bottom 0.2: U6.7 58.5,17.44 59.56,18.5 C16.1 R7.2
N$30
  Bottom 0.254: U1.8 R14.1
N$31
  Bottom 0.254: R15.1 70.2,14.2 72.14,16.14 Q8.3
N$32  (via drill 0.25)
  Top 0.203: v87.06,79.25 87.06,81.5 88.56,83 TP56.TP
  Bottom 0.203: U16.12 85.47,77.66 v87.06,79.25
N$33  (via drill 0.25)
  Top 0.254: v73.5,70.62 72.62,71.5 TP11.TP
  Bottom 0.254: U5.4 73.12,71 v73.5,70.62
N$35
  Bottom 0.2: U5.7 66.94,71 66.14,71.8 C15.1 R6.2
N$36  (via drill 0.25)
  Top 0.254: v57,82.69 58.12,81.56 63.94,81.56 69.81,75.69 73.31,75.69 73.69,76.06 v73.69,77.89 | v12.5,74 12.5,73.94 11.19,72.63 11.19,62.69 TP18.1
  Bottom 0.254: U7.2 9.2,44.76 11.26,46.83 11.26,54.89 R20.4 11.23,55.96 10.62,56.57 10.62,62.12 TP18.1 16.19,67.69 16.19,78.88 18.93,81.62 25.13,81.62 26.88,79.88 26.88,69.44 27.5,68.81 29,68.81 29.5,69.31 U2.3 | v57,82.69 56.92,82.76 18.41,82.76 14.93,79.28 14.93,78.43 12.5,76 v12.5,74 | U4.3 73.57,78 v73.69,77.89
N$39  (via drill 0.25)
  Top 0.254: TP8.TP 72.38,78.5 72.88,78 v72.88,76.25
  Bottom 0.254: U4.4 73.25,77.5 73.56,77.19 73.56,76.5 73.31,76.25 v72.88,76.25
N$40
  Bottom 0.2: U4.7 66.8,77.5 C14.1 R5.2
N$44
  Bottom 0.254: R2.11 R2.12 | R2.11 | R2.11 11.24,31.52 11.72,32 13.12,32 13.62,32.5 13.62,40.38 11.8,42.2 U7.6
N$98  (via drill 0.25)
  Top 0.203: v79.06,87.69 v77.31,89.44
  Bottom 0.203: U14.16 78.47,87.1 v79.06,87.69 | R63.1 v77.31,89.44
  pour Bottom (rank 2, no thermals): 70.5,91.5 70.5,89.5 73.5,89.5 75,88 77,88 77,91 77,92 70.5,92
N$99
  Bottom 0.203: U14.15 77.83,87.38 78.95,88.51 R63.2
  pour Bottom (no thermals): 78,90.5 79.81,90.5 80.69,89.62 81.81,89.62 82.06,89.38 82.06,87.06 82,87 79.5,87 78,88.5
N$100
  Bottom 0.203: C35.1 R44.1 | R45.1 R44.1 | R44.1 92.26,68.08 92.66,68.47 93.22,68.47 U13.1
N$113
  Bottom 0.203: Q3.3 84.97,66.85 R43.2
N$117
  Bottom 0.203: R35.2 84.78,64.53 85.2,64.95 Q3.1
N$270
  Bottom 0.254: D7.A 91.7,87.92 R61.1
N$385  (via drill 0.25)
  Top 0.203: v85.81,79.19 85.81,81 89.81,85 TP53.TP
  Bottom 0.203: U16.11 84.83,78.2 v85.81,79.19
N$479
  Bottom 0.203: Q3.5 87.72,65.9 87,66.62 87,67.69 85.66,69.03 R48.2
N$575
  Bottom 0.254: D6.A 91.62,81.08 R49.1
N$579
  Bottom 0.203: Q3.2 84.42,65.9 R41.2
N$580  (via drill 0.25)
  Top 0.203: TP43.TP 82.25,59.5 81.88,59.88 v81.88,67.5
  Bottom 0.203: U13.4 95.15,66.65 95.38,66.88 95.38,68.94 95,69.31 92.69,69.31 92.25,68.88 88.56,68.88 87.62,69.81 83.75,69.81 83.5,69.56 83.5,67.75 83.25,67.5 82.72,67.5 R43.1 81.9,67.53 v81.88,67.5
N$589  (via drill 0.25)
  Top 0.203: v84.62,71.44 84.62,72.88 86.69,74.94 v86.69,77.38
  Bottom 0.203: R72.1 82.7,71.2 83.06,71.56 84.5,71.56 v84.62,71.44 | U16.13 86.36,77.05 v86.69,77.38
N$590  (via drill 0.25)
  Top 0.203: v74.88,87.81 74.88,88.38 76.5,90 84.5,90 v87,92.5
  Bottom 0.203: Q6.3 73.8,88.3 73.3,87.8 R52.1 74.06,87 v74.88,87.81 | Q4.3 v87,92.5
N$596  (via drill 0.25)
  Top 0.203: v74,84.67 72.7,83.38 71.62,83.38 69.6,85.4 TP57.TP
  Bottom 0.203: U14.10 v74,84.67 73.31,84.67 73.3,84.69
  Bottom 0.254: R51.2 73.3,84.69 R50.1
N$597  (via drill 0.25)
  Top 0.203: TP47.TP 70.41,86.9 v71.06,86.25
  Bottom 0.203: R42.2 70.3,86.19 | 70.3,86.19 R47.1 | U14.11 74.74,85.33 73.81,86.25 v71.06,86.25 70.36,86.25 70.3,86.19
N$599  (via drill 0.25)
  Top 0.203: 74.69,82.94 v74.69,86.62 | v75.5,82.56 75.06,82.56 74.69,82.94 | 74.69,82.94 71.31,82.94 v69.5,84.75
  Bottom 0.203: U14.8 76.08,83.14 v75.5,82.56 | U14.12 74.9,85.97 74.69,86.19 v74.69,86.62 | R47.2 69.31,85.5 69.5,85.31 v69.5,84.75
N$603
  Bottom 0.203: C33.1 R38.2 R33.2
N$604  (via drill 0.25)
  Top 0.203: v79.38,83.25 81.88,83.25 v82.5,83.88
  Bottom 0.203: U14.5 79.27,83.14 v79.38,83.25 | R38.1 82.75,84.5 82.5,84.25 v82.5,83.88
ON/!OFF  (via drill 0.25)
  Top 0.203: v80.5,84 80.5,85.62 v79.31,86.81 | v89,87.5 90.5,89 TP50.TP | v82.94,77.19 83.69,77.19 84.12,77.62 84.12,79.31 v82.56,80.88
  Bottom 0.203: R46.2 87.8,88.7 Q4.1 | C34.1 81.12,81.5 80.5,82.12 v80.5,84 | U14.1 79.31,86.02 v79.31,86.81 | C34.1 82.25,81.5 82.5,81.75 82.5,82.06 82.69,82.25 84.38,82.25 85.06,82.94 85.06,83.19 87.06,85.19 87.06,87.19 87.34,87.46 R46.2 | R46.2 87.84,87.5 v89,87.5 92.5,84 92.5,81.19 92.69,81 R49.2 | v82.94,77.19 82.92,77.19 82.64,76.91 U16.8 | v82.56,80.88 82.56,81.06 82.12,81.5 C34.1
OPD_PWR
  Top 0.305: J4.15 J4.16
  Bottom 0.813: J4.16 53.06,87.25 53.06,85.44 54.48,84.03 R71.1
OPD_SCL  (via drill 0.25)
  Top 0.254: J4.14 54.34,86.12 58.28,82.18 74.28,82.18 74.91,81.56 78.91,81.56 81.56,78.91 81.56,76.41 82.73,75.23 83.64,74.32 83.64,70.51 82.81,69.69 v81.88,69.69
  Top 0.305: J4.13 J4.14
  Bottom 0.254: R48.1 82.54,69.03 v81.88,69.69
OPD_SDA  (via drill 0.25)
  Top 0.254: J4.12 55.62,87 55.62,85.39 58.44,82.56 74.44,82.56 75.06,81.94 79.06,81.94 81.94,79.06 81.94,76.62 84.12,74.44 84.12,67.25 v83.5,66.62
  Top 0.305: J4.11 55.62,87
  Bottom 0.254: R41.1 83.15,66.03 83.5,66.38 v83.5,66.62
OUT1N
  Top 0.381: U1.14 arc-45 52.88,70.35 52.88,74.71 arc45 51.95,76.95 50.1,78.8 arc45 46.72,80.2 30.91,80.2 arc-45 26.78,81.91 25.5,83.19 arc-45 24.75,85 24.75,85.62 25.07,85.95 J2.6 J2.5
OUT1P
  Top 0.381: U1.13 arc45 52.12,73.81 52.12,74.99 arc45 51.5,76.5 49.65,78.35 arc45 46.72,79.56 30.91,79.56 arc-45 26.33,81.46 25.05,82.74 arc-45 24.11,85 24.11,85.62 23.8,85.94 J2.8 J2.7
PB6/SCL  (via drill 0.25)
  Top 0.203: v82.5,72 TP67.TP
  Bottom 0.203: U16.4 82.5,72.61 v82.5,72
PB7/SDA  (via drill 0.25)
  Top 0.203: v82.56,73.94 82.56,73.06 TP68.TP
  Bottom 0.203: U16.5 82.56,74.45 v82.56,73.94
PEN-SCL-FILT  (via drill 0.25)
  Top 0.203: v87.69,59.94 87.69,61.44 v88.81,62.56 | v88.94,71.25 88.94,64.56 v88.31,63.94 | TP42.TP 83.19,55.31 92.49,55.31 93.99,56.81 v93.99,57
  Bottom 0.203: R37.2 89.33,62.05 v88.81,62.56 88.3,63.08 v88.3,63.95 v88.31,63.94 88.36,63.99 Q3.6 | 90,58.94 R67.1 | 90,58.94 90.31,58.62 92.81,58.62 93,58.81 R65.1 93.61,59.33 93.99,58.95 v93.99,57 | 90,58.94 89.69,58.62 87.25,58.62 87,58.88 R69.1 87.61,59.94 v87.69,59.94 | U16.15 87.2,75.17 88.3,74.07 88.3,72.61 88.94,71.98 v88.94,71.25
PEN-SDA-FILT  (via drill 0.25)
  Top 0.203: v87.88,72 88.31,71.56 v88.31,67.94 | TP41.TP 83.75,57.5 84.69,58.44 84.69,60.19 v84.94,60.44
  Bottom 0.203: R66.2 91.5,60.25 91.75,60.5 | 91.75,60.5 94.38,60.5 95.56,61.69 95.56,65.38 95.25,65.69 92.88,65.69 92.26,65.08 R45.2 91.5,65.69 91.31,65.88 89.62,65.88 88.65,66.85 Q3.4 88.31,66.9 v88.31,67.94 | 91.75,60.5 88.94,60.5 | R68.2 88.5,60.06 88.94,60.5 | R70.2 85.5,60.06 | 88.94,60.5 85.94,60.5 85.5,60.06 | U16.16 87.22,74.53 87.81,73.94 87.81,72.06 v87.88,72 | v84.94,60.44 85.12,60.44 85.5,60.06
POUT  (via drill 0.25)
  Top 0.203: TP64.TP 75,92.5 v75.19,92.69
  Bottom 0.203: U14.13 76.53,87.65 77.81,88.94 77.81,89.94 77.5,90.25 77.5,92.38 77.12,92.75 75.25,92.75 v75.19,92.69
REFCLK_ENABLE  (via drill 0.25)
  Top 0.254: v9.5,40 11,41.5 11,44.94 v12.88,46.81 | TP27.1 15,71 14.25,71.75 12.75,71.75 12.12,71.12 v12.12,71.06
  Bottom 0.254: U7.13 9.2,39.7 v9.5,40 | TP27.1 13.16,60.66 13.16,56.78 12.5,56.12 R20.3 12.5,47.19 v12.88,46.81 | X1.1 12.1,71.04 v12.12,71.06
SENSOR_ENABLE  (via drill 0.25)
  Top 0.254: v16.62,81.88 16.62,81.62 16.86,81.39 16.86,35.86 TP39.1
  Bottom 0.254: R8.1 16.5,35.5 TP39.1 | J2.13 J2.14 20,85.25 v16.62,81.88
SPI_CLK
  Top 0.254: U1.26 59.42,21.51 55.53,17.62 19.84,17.62 17.62,19.84 17.62,84.38 17.45,84.55 J2.18 J2.17
SPI_MISO
  Top 0.254: U1.27 58.16,20.97 55.19,18 20,18 18,20 18,84.5 18.73,85.22 J2.16 J2.15
SPI_MOSI
  Top 0.254: J2.19 J2.20 16.18,85.19 17.24,84.14 17.24,19.68 19.68,17.24 55.8,17.24 60.7,22.13 U1.25
TEC+  (via drill 0.25)
  Bottom 0.254: Q7.2 69.5,18.62 69.25,18.88 65.88,18.88 64,17 64,9.5 61,6.5 R11.2
  other vias: 64.5,30.5 64.5,29 64.5,27.5 65.5,27 65.5,28.5 65.5,30
  pour Bottom (rank 2, no thermals): 69.06,17.12 72,17.12 72,27 68,31 62,31 62,29.31 69.06,22.25
  pour Top: 62,31 62,29 66,25 66,31
TEC_ENABLE  (via drill 0.25)
  Top 0.254: v15.88,81.25 16.48,80.65 16.48,37.73 14.31,35.56 14.31,33.38 16.86,30.83 16.86,19.53 19.53,16.86 69.44,16.86 73.29,13 v74.56,13
  Bottom 0.254: v15.88,81.25 15.88,84.31 15.06,85.12 15.06,90.56 15.38,90.88 21.88,90.88 22.54,90.22 J2.9 J2.10 | Q8.1 73.8,14.2 R10.2 75.5,13.56 74.94,13 v74.56,13
THERM+
  Top 0.254: J2.11 J2.12
  Top 0.305: U1.1 36.56,75 33.38,78.19 28.53,78.19 28.21,78.51 26.99,78.51 21.27,84.23 J2.12
TXCLKN
  Top 0.381: U1.16 55.38,70.11 55.38,74.37 arc45 53.41,79.11 52.27,80.26 arc45 46.22,82.76 30.39,82.76 arc-45 28.14,83.69 arc-45 27.31,85.69 27.61,85.99 J2.2 J2.1
TXCLKP
  Top 0.381: U1.15 54.69,73.38 54.69,74.49 arc45 52.96,78.67 51.82,79.81 arc45 46.22,82.12 30.39,82.12 arc-45 27.69,83.24 arc-45 26.68,85.69 26.34,86.02 J2.4 J2.3
VBUS  (via drill 0.25)
  Bottom 0.203: R52.2 71.7,87.8 71.2,88.3 Q6.4
  other vias: 67.5,90.5 68.5,90.5 69.5,89.5 68.5,89.5 67.5,89.5 67.5,88.5 68.5,88.5 69.5,88.5
  pour Route15 (isolate 0.2, no thermals): 46.12,84 46.12,91.12 47,92 72,92 72,88.5 67.5,84
  pour Bottom (no thermals): 72,89.5 72,88.5 71.5,88 67.5,88 67,88.5 67,90.5 67.5,91 69,91 70.5,89.5
VBUSP  (via drill 0.25, 0.65)
  Top 0.203: TP55.TP v92.5,92.38
  Bottom 0.203: v84.5,93.5 87.06,93.5 88.19,92.38 v92.5,92.38 93.5,92.38 94.81,91.06 94.81,86.81 94.5,86.5 R61.2 | v56.94,16.06 56.94,16.22 57.38,16.66 U6.6 | v46.25,16.06 46.25,16.16 46.75,16.66 U3.6 | U4.6 67.84,76.16 v68.19,75.81
  Bottom 0.254: U5.6 67.84,69.84 v67.75,69.75 | v27.75,75.25 28.41,75.25 U2.6 | C33.2 v84.12,86 | v66.5,13.31 R9.2 C21.1
  Bottom 0.508: v14,85 C18.1 13.85,83.45 U8.1 11.07,83.45 10.62,83 10.62,82 11.07,81.55 U8.3
  other vias: 80.5,93.5 81,92.5 81.5,93.5 82,92.5 82.5,93.5 83,92.5 83.5,93.5 84,92.5 73.5,81 73.5,79.75 73.69,78.56 73.5,74.5 73.5,73.25 73.62,72.06 32.5,69.5 31.25,69.5 30.12,69.25 62,11 60.75,11 59.56,10.81 51.5,11 50.25,11 49.12,11 67.06,21.69 67.06,20.62 67.5,19.94 68.38,21.69 67.75,20.94
  pour Bottom (rank 2, no thermals): 80,90.5 80.75,89.75 84.31,89.75 85.5,90.94 85.5,93.69 80,93.69
  pour Bottom (no thermals): 71,78.5 71,79.5 71.5,80 71.5,81.5 74,81.5 74,78 71,78
  pour Bottom (no thermals): 71,72 71,73 71.5,73.5 71.5,75 74,75 74,71.5 71,71.5
  pour Bottom (no thermals): 30,72 31,72 31.5,71.5 33,71.5 33,69 29.5,69 29.5,72
  pour Route15 (isolate 0.2, rank 2): 2.06,87.56 2.06,16.06 13.06,5.06 85.75,5.06 97.75,17.06 97.75,87.75 93.5,92 6.5,92
  pour Bottom (no thermals): 59.5,13.5 60.5,13.5 61,13 62.5,13 62.5,10.5 59,10.5 59,13.5
  pour Bottom (no thermals): 49,13.5 50,13.5 50.5,13 52,13 52,10.5 48.5,10.5 48.5,13.5
  pour Bottom (no thermals): 66.56,22.12 68.94,22.12 68.94,19.44 66.56,19.44
  pour Route15 (rank 2, no thermals): 80,90.5 80.75,89.75 84.31,89.75 85.5,90.94 85.5,93.69 80,93.69
VDETCOM-2.9V
  Bottom 0.508: TP22.TP 51.19,22 52.24,23.05 C102.1 U1.31
  pour Bottom (no thermals): 48.12,15.75 51.94,15.75 51.94,21.5 48.12,21.5
VPD  (via drill 0.25, 0.5)
  Top 0.203: TP63.TP 91.5,79 v91,79.5
  Top 0.305: v94,70.5 v94,66.62 v94,63.12 94.5,62.62 v94.5,54.62
  Bottom 0.203: R72.2 89.03,70.53 90.47,71.97 | R53.2 93,55.19 92.75,55.44 90.38,55.44 90,55.06 | R55.2 90,55.06 | 90,55.06 89.62,55.44 87.25,55.44 87,55.19 R57.2 | v91,79.5 90,79.5 89.25,78.75
  Bottom 0.305: U13.5 93.97,66.65 v94,66.62 | v94,63.12 93.97,63.15 U12.5 93.35,62.6 92.8,62.05 R36.2 | R53.2 94.46,54.66 v94.5,54.62 | U16.14 87.88,75.83 C39.2
  Bottom 0.508: 91.5,70.94 91.94,70.5 v94,70.5 | R32.2 86.2,80.26 86,80.06
  Bottom 0.813: R44.2 91.5,70.94 90.47,71.97 89.06,73.38 89.06,75.39 88.75,75.7 C39.2 88.76,75.7 89.5,76.44 89.5,78.5 89.25,78.75 87.94,80.06 86,80.06 81.38,80.06 79.89,81.55 75.18,81.55 74.27,82.46 68.04,82.46 66.47,84.03 R71.2
VPH-3.3V  (via drill 0.25)
  Top 0.203: v67.75,73.12 68.5,72.38 TP25.TP
  Bottom 0.203: C9.1 67.75,73.95 v67.75,73.12
  Bottom 0.508: C9.1 67.7,74.86 66.81,75.75 62.81,75.75 62.67,75.89 60.06,75.89 C100.1 60,74.75 59.42,74.17 U1.19
  pour Bottom (no thermals): 68.81,70.81 68.81,73.19 68.5,73.5 68.5,74.5 64.5,74.5 64.5,70.81
VPL-1.6V
  Bottom 0.508: C8.1 67.7,81.24 66.69,82.25 64.75,82.25 63.44,80.94 59.94,80.94 TP24.TP 59,76.38 58.58,75.95 C101.1 58,74.81 58.16,74.66 U1.18
  pour Bottom (no thermals): 68.81,77.31 68.81,79.69 68.5,80 68.5,81 64.5,81 64.5,77.31
VPOS-3.3V
  Bottom 0.508: U1.30 54.34,24.66 54.69,24.31 C103.1 56.01,23.05 57.94,21.12 61.31,21.12 TP26.TP
  pour Bottom (no thermals): 58.62,15.75 62.44,15.75 62.44,21.5 58.62,21.5
VPOUT-0.9V
  Bottom 0.508: C7.1 33.8,75.3 34.75,76.25 37.5,76.25 | U1.5 41.62,73.06 C104.1 37.8,75.95 37.5,76.25 | 37.5,76.25 TP23.TP
  pour Bottom (no thermals): 28.81,74.19 31.19,74.19 31.5,74.5 32.5,74.5 32.5,78.5 28.81,78.5

### Text on the board
tPlace: CONNECTOR THIS SIDE | CONNECTOR THIS SIDE | GND | GND | VPL-1.6V | VPH-3.3V | VPOUT-0.9V | GND | VDETCOM-2.9V | VPOS-3.3V | GND | OreSat CFC Sensor Card v1.0 | OLIVER REW | 2021/08/01
bPlace: VBUSP | ON/OFF | SENSOR / ENABLE | TEC PWR
Measures: DOUBLE CHECK THESE | Inner pin signal should be 3.15mm / longer that outer pin signal for the / pair to be balanced because of the / pin row offset | OH FUCK DONT / LET THIS BE / UPSIDE DOWN | TODO label relevant PIRT1280 pins on top